# Altium project BEE-1012 PAY-EXP_V12.PrjPcb (part 3 of 4)

## Sheet 11_MCU.SchDoc
size 420 x 297 mm; SheetNumber: 20; SheetTotal: 36
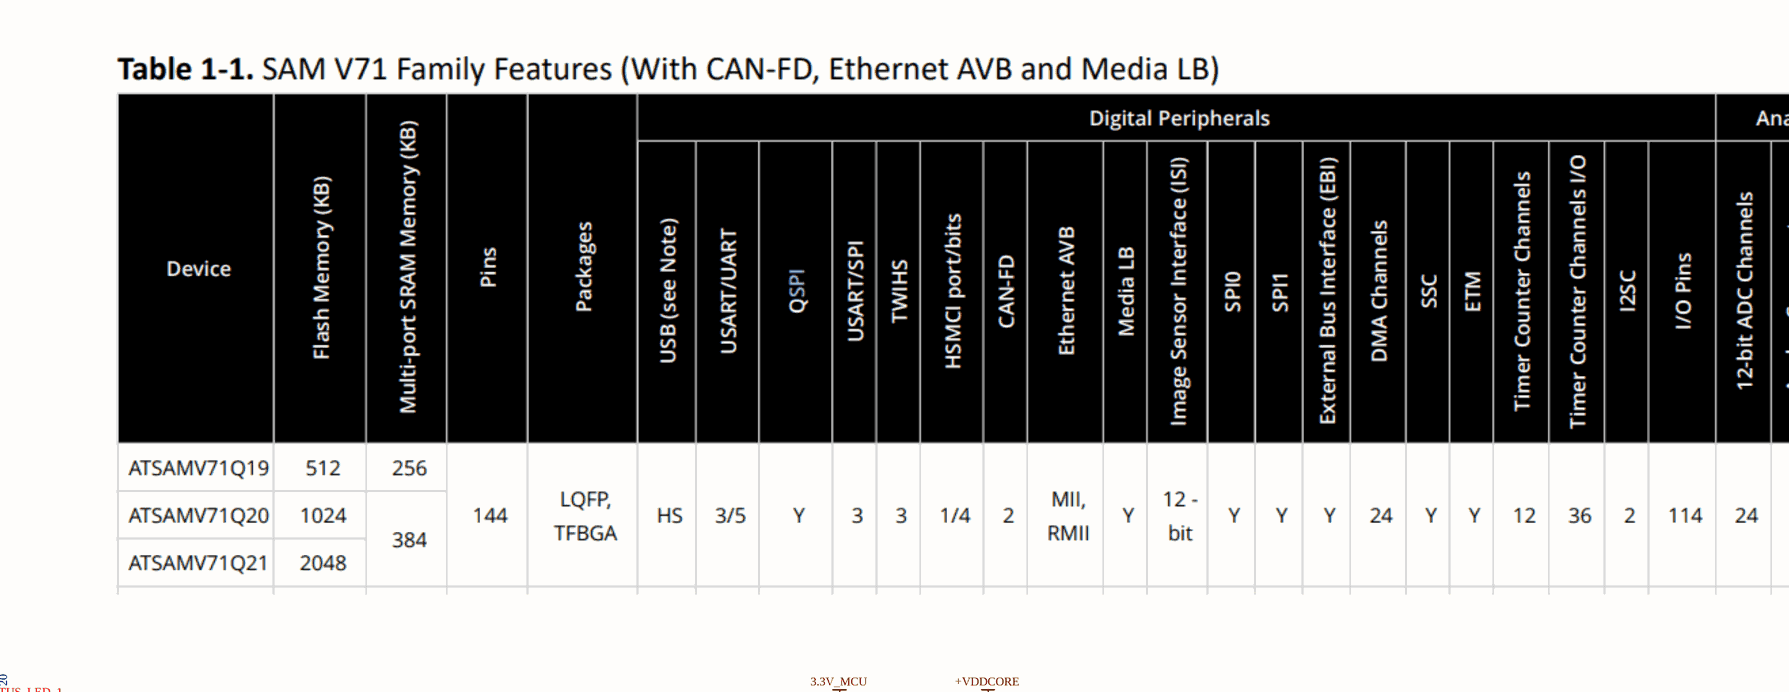
[diagram p18: 11_MCU.SchDoc, top left]
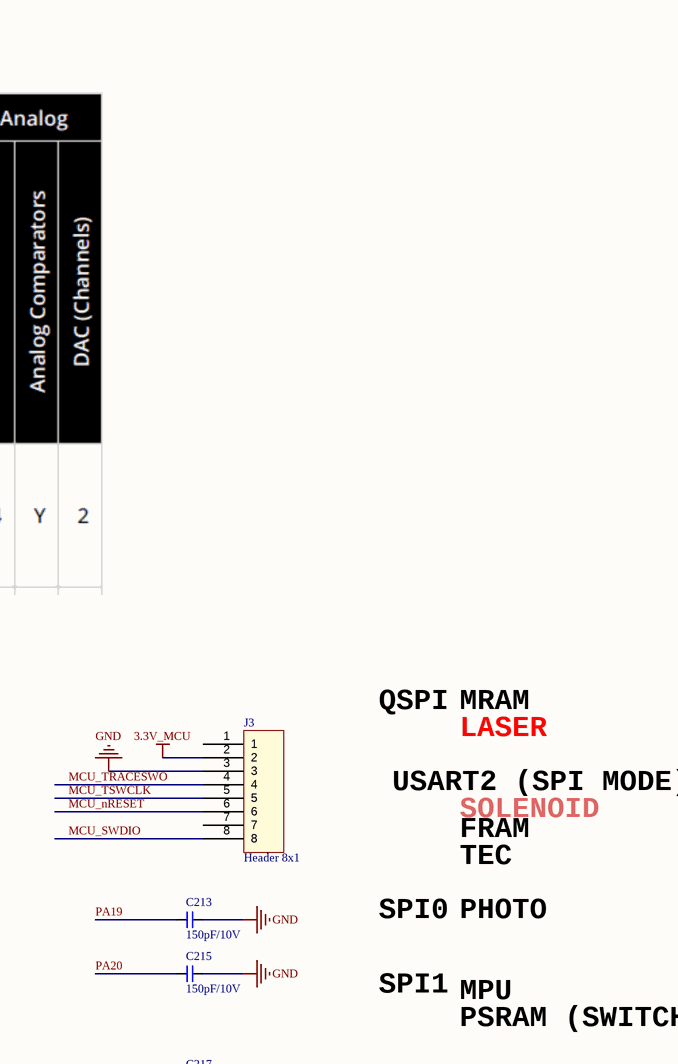
[diagram p19: 11_MCU.SchDoc, top right]
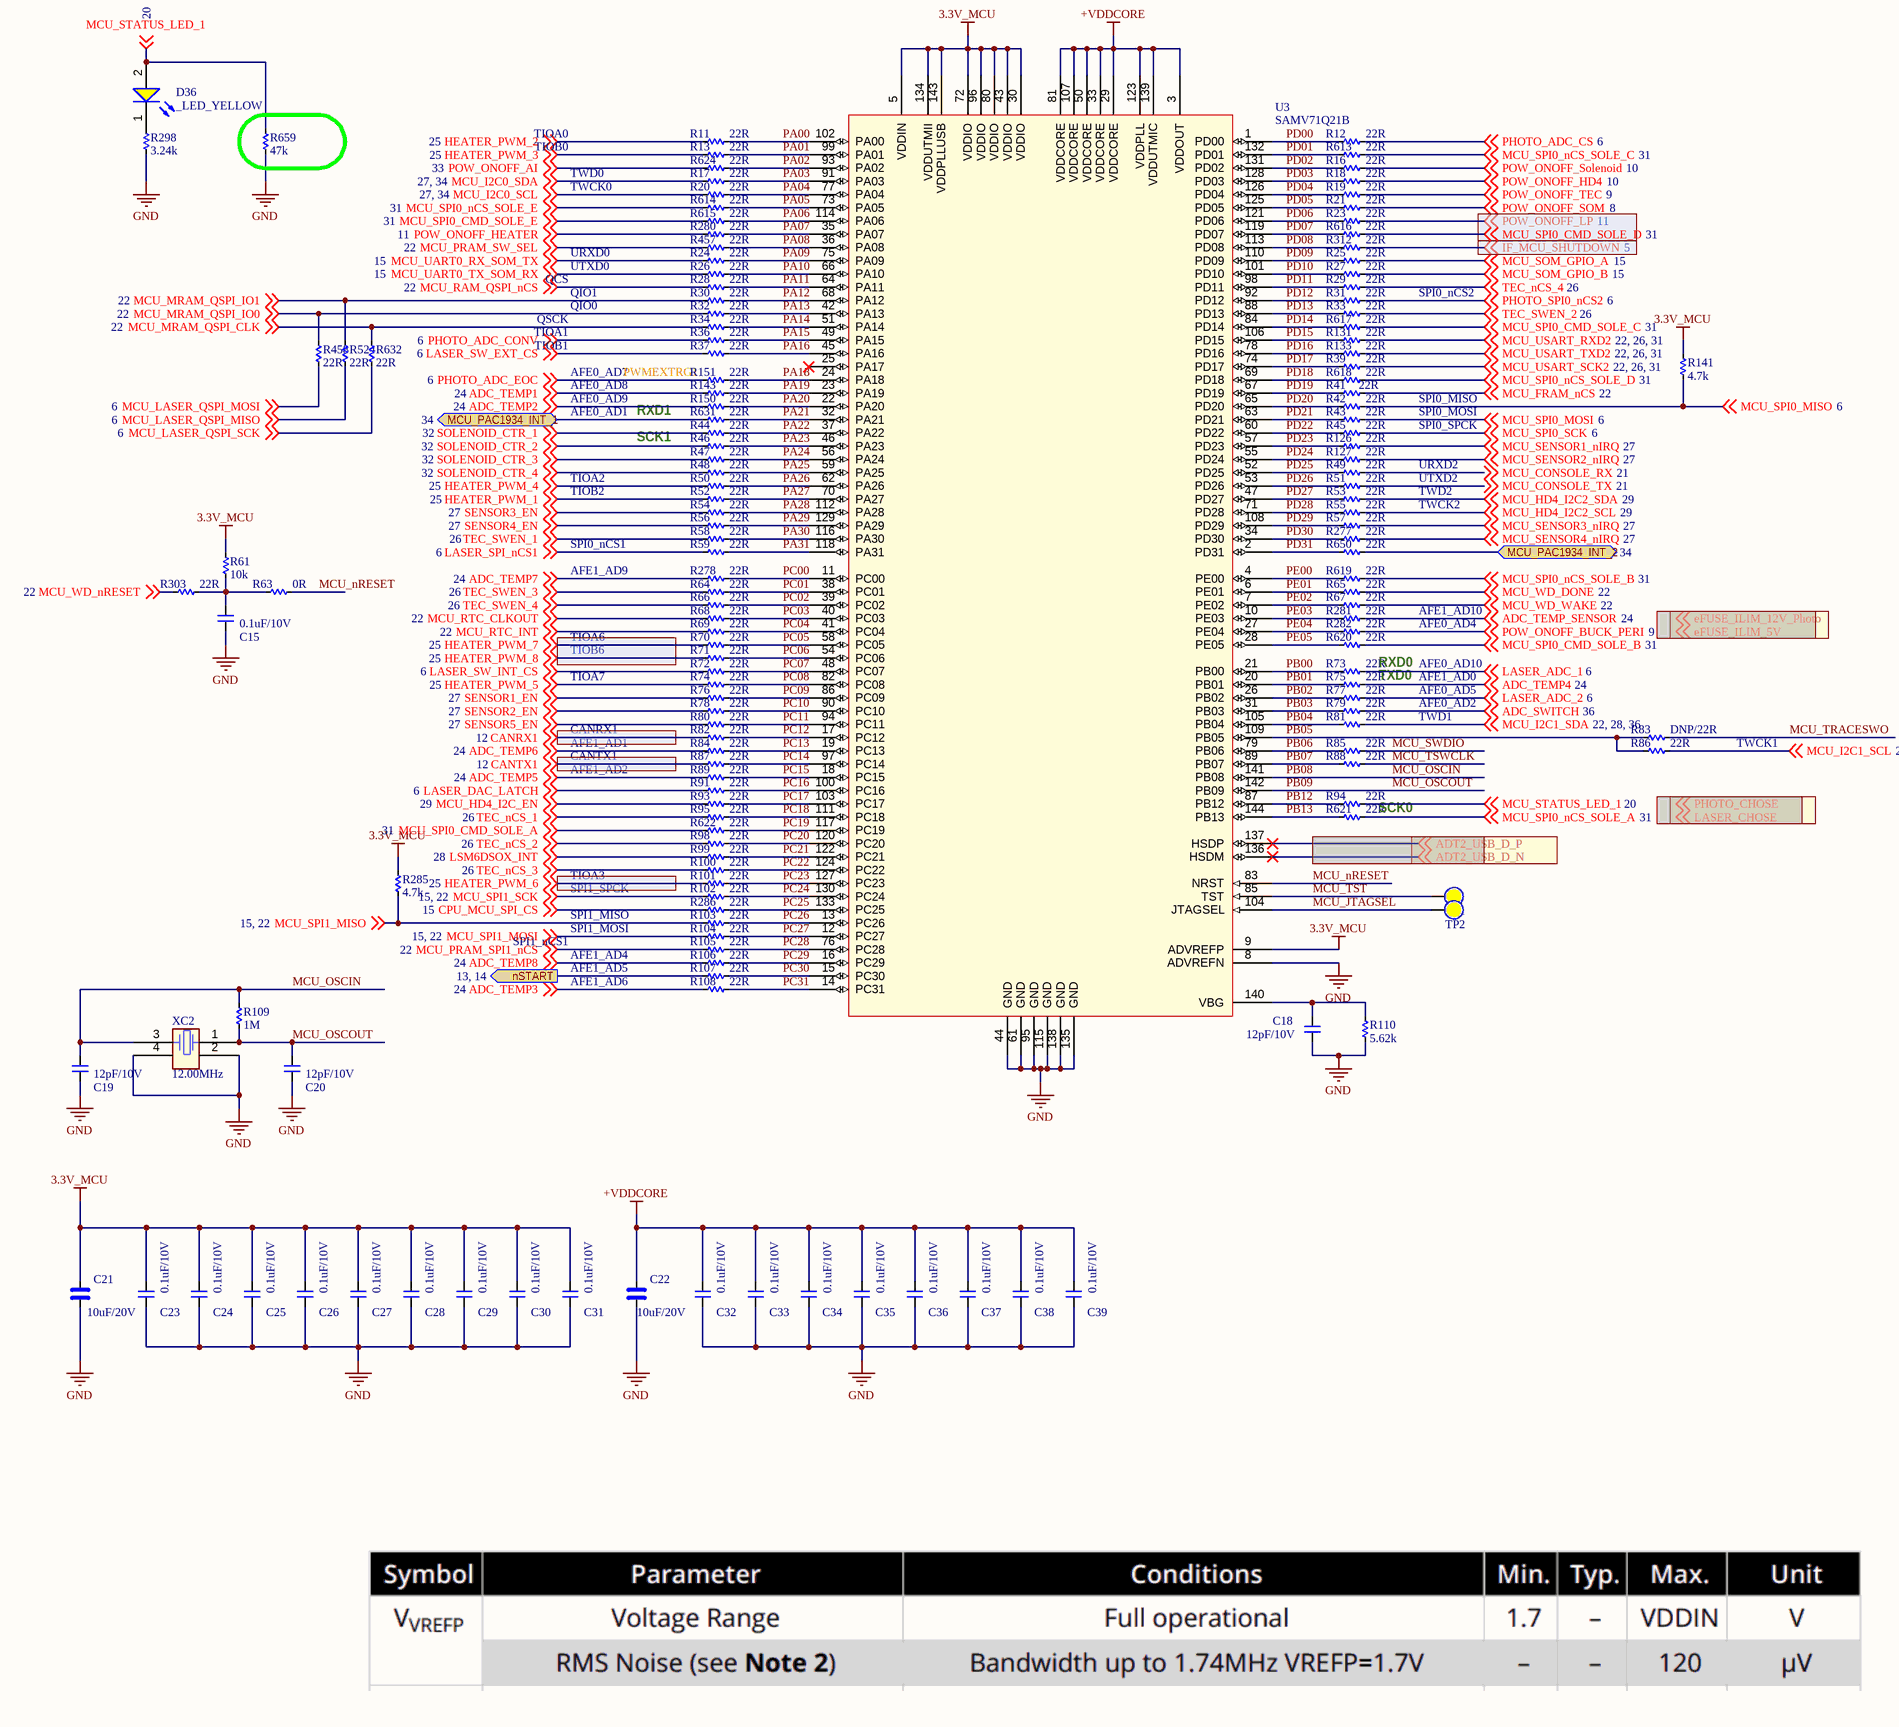
[diagram p20: 11_MCU.SchDoc, bottom left]
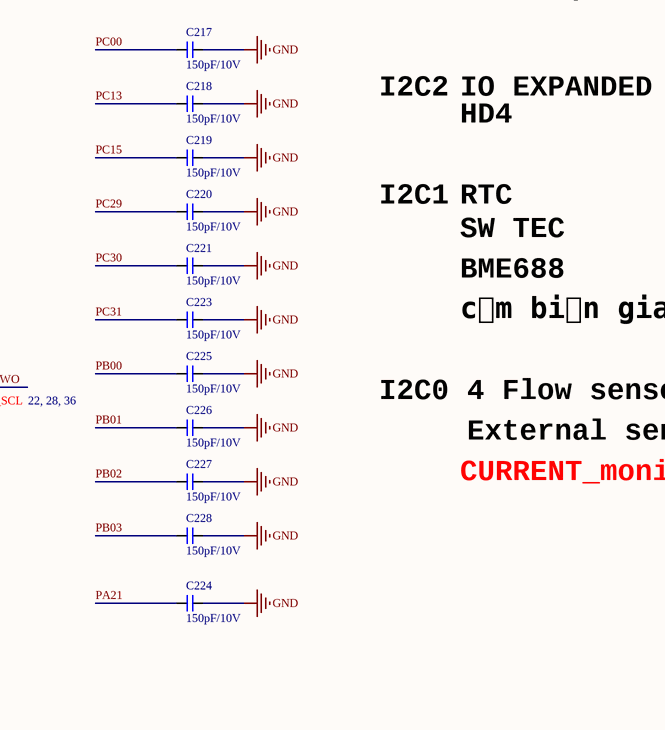
[diagram p21: 11_MCU.SchDoc, bottom right]

### Parts
C15  0.1uF/10V  [CAP_C_1005X60]
C18  12pF/10V  [CAP_C_1005X60]
C19  12pF/10V  [CAP_C_1005X60]
C20  12pF/10V  [CAP_C_1005X60]
C21  10uF/20V  [CAP_C_2012X110]
C22  10uF/20V  [CAP_C_2012X110]
C23  0.1uF/10V  [CAP_C_1005X60]
C24  0.1uF/10V  [CAP_C_1005X60]
C25  0.1uF/10V  [CAP_C_1005X60]
C26  0.1uF/10V  [CAP_C_1005X60]
C27  0.1uF/10V  [CAP_C_1005X60]
C28  0.1uF/10V  [CAP_C_1005X60]
C29  0.1uF/10V  [CAP_C_1005X60]
C30  0.1uF/10V  [CAP_C_1005X60]
C31  0.1uF/10V  [CAP_C_1005X60]
C32  0.1uF/10V  [CAP_C_1005X60]
C33  0.1uF/10V  [CAP_C_1005X60]
C34  0.1uF/10V  [CAP_C_1005X60]
C35  0.1uF/10V  [CAP_C_1005X60]
C36  0.1uF/10V  [CAP_C_1005X60]
C37  0.1uF/10V  [CAP_C_1005X60]
C38  0.1uF/10V  [CAP_C_1005X60]
C39  0.1uF/10V  [CAP_C_1005X60]
C213  150pF/10V  [CAP_C_1005X60]
C215  150pF/10V  [CAP_C_1005X60]
C217  150pF/10V  [CAP_C_1005X60]
C218  150pF/10V  [CAP_C_1005X60]
C219  150pF/10V  [CAP_C_1005X60]
C220  150pF/10V  [CAP_C_1005X60]
C221  150pF/10V  [CAP_C_1005X60]
C223  150pF/10V  [CAP_C_1005X60]
C224  150pF/10V  [CAP_C_1005X60]
C225  150pF/10V  [CAP_C_1005X60]
C226  150pF/10V  [CAP_C_1005X60]
C227  150pF/10V  [CAP_C_1005X60]
C228  150pF/10V  [CAP_C_1005X60]
D36  _LED_YELLOW  [LED_0603]
J3  Header 8x1  [Header_254P_8x1]
R11  22R  [RES_C_1005X40]
R12  22R  [RES_C_1005X40]
R13  22R  [RES_C_1005X40]
R16  22R  [RES_C_1005X40]
R17  22R  [RES_C_1005X40]
R18  22R  [RES_C_1005X40]
R19  22R  [RES_C_1005X40]
R20  22R  [RES_C_1005X40]
R21  22R  [RES_C_1005X40]
R23  22R  [RES_C_1005X40]
R24  22R  [RES_C_1005X40]
R25  22R  [RES_C_1005X40]
R26  22R  [RES_C_1005X40]
R27  22R  [RES_C_1005X40]
R28  22R  [RES_C_1005X40]
R29  22R  [RES_C_1005X40]
R30  22R  [RES_C_1005X40]
R31  22R  [RES_C_1005X40]
R32  22R  [RES_C_1005X40]
R33  22R  [RES_C_1005X40]
R34  22R  [RES_C_1005X40]
R36  22R  [RES_C_1005X40]
R37  22R  [RES_C_1005X40]
R39  22R  [RES_C_1005X40]
R41  22R  [RES_C_1005X40]
R42  22R  [RES_C_1005X40]
R43  22R  [RES_C_1005X40]
R44  22R  [RES_C_1005X40]
R45  22R  [RES_C_1005X40]
R46  22R  [RES_C_1005X40]
R47  22R  [RES_C_1005X40]
R48  22R  [RES_C_1005X40]
R49  22R  [RES_C_1005X40]
R50  22R  [RES_C_1005X40]
R51  22R  [RES_C_1005X40]
R52  22R  [RES_C_1005X40]
R53  22R  [RES_C_1005X40]
R54  22R  [RES_C_1005X40]
R55  22R  [RES_C_1005X40]
R56  22R  [RES_C_1005X40]
R57  22R  [RES_C_1005X40]
R58  22R  [RES_C_1005X40]
R59  22R  [RES_C_1005X40]
R61  10k  [RES_C_1005X40]
R63  0R  [RES_C_1005X40]
R64  22R  [RES_C_1005X40]
R65  22R  [RES_C_1005X40]
R66  22R  [RES_C_1005X40]
R67  22R  [RES_C_1005X40]
R68  22R  [RES_C_1005X40]
R69  22R  [RES_C_1005X40]
R70  22R  [RES_C_1005X40]
R71  22R  [RES_C_1005X40]
R72  22R  [RES_C_1005X40]
R73  22R  [RES_C_1005X40]
R74  22R  [RES_C_1005X40]
R75  22R  [RES_C_1005X40]
R76  22R  [RES_C_1005X40]
R77  22R  [RES_C_1005X40]
R78  22R  [RES_C_1005X40]
R79  22R  [RES_C_1005X40]
R80  22R  [RES_C_1005X40]
R81  22R  [RES_C_1005X40]
R82  22R  [RES_C_1005X40]
R83  DNP/22R  [RES_C_1005X40]
R84  22R  [RES_C_1005X40]
R85  22R  [RES_C_1005X40]
R86  22R  [RES_C_1005X40]
R87  22R  [RES_C_1005X40]
R88  22R  [RES_C_1005X40]
R89  22R  [RES_C_1005X40]
R91  22R  [RES_C_1005X40]
R93  22R  [RES_C_1005X40]
R94  22R  [RES_C_1005X40]
R95  22R  [RES_C_1005X40]
R98  22R  [RES_C_1005X40]
R99  22R  [RES_C_1005X40]
R100  22R  [RES_C_1005X40]
R101  22R  [RES_C_1005X40]
R102  22R  [RES_C_1005X40]
R103  22R  [RES_C_1005X40]
R104  22R  [RES_C_1005X40]
R105  22R  [RES_C_1005X40]
R106  22R  [RES_C_1005X40]
R107  22R  [RES_C_1005X40]
R108  22R  [RES_C_1005X40]
R109  1M  [RES_C_1005X40]
R110  5.62k  [RES_C_1005X40]
R126  22R  [RES_C_1005X40]
R127  22R  [RES_C_1005X40]
R131  22R  [RES_C_1005X40]
R133  22R  [RES_C_1005X40]
R141  4.7k  [RES_C_1005X40]
R143  22R  [RES_C_1005X40]
R150  22R  [RES_C_1005X40]
R151  22R  [RES_C_1005X40]
R277  22R  [RES_C_1005X40]
R278  22R  [RES_C_1005X40]
R280  22R  [RES_C_1005X40]
R281  22R  [RES_C_1005X40]
R282  22R  [RES_C_1005X40]
R285  4.7k  [RES_C_1005X40]
R286  22R  [RES_C_1005X40]
R298  3.24k  [RES_C_1005X40]
R303  22R  [RES_C_1005X40]
R312  22R  [RES_C_1005X40]
R457  22R  [RES_C_1005X40]
R458  22R  [RES_C_1005X40]
R524  22R  [RES_C_1005X40]
R613  22R  [RES_C_1005X40]
R614  22R  [RES_C_1005X40]
R615  22R  [RES_C_1005X40]
R616  22R  [RES_C_1005X40]
R617  22R  [RES_C_1005X40]
R618  22R  [RES_C_1005X40]
R619  22R  [RES_C_1005X40]
R620  22R  [RES_C_1005X40]
R621  22R  [RES_C_1005X40]
R622  22R  [RES_C_1005X40]
R624  22R  [RES_C_1005X40]
R631  22R  [RES_C_1005X40]
R632  22R  [RES_C_1005X40]
R650  22R  [RES_C_1005X40]
R659  47k  [RES_C_1608X60]
TP1  (no value)  [Testpoint_80]  (no BOM)
TP2  (no value)  [Testpoint_80]  (no BOM)
U3  SAMV71Q21B  [AP6-00118]
XC2  value 12.00MHz  [AP7-00039]  (hidden comment: FC5BQCCMC12.0-T1)

### Ports
MCU_PAC1934_INT_1 (bidir, see 34), MCU_PAC1934_INT_2 (bidir, see 34), nSTART (out, see 13, 14)

### Nets
3.3V_MCU: C21.1 C23.2 C24.2 C25.2 C26.2 C27.2 C28.2 C29.2 C30.2 C31.2 J3.2 R61.2 R141.1 R285.1 U3.5(VDDIN) U3.9(ADVREFP) U3.30(VDDIO) U3.43(VDDIO) U3.72(VDDIO) U3.80(VDDIO) U3.96(VDDIO) U3.134(VDDUTMII) U3.143(VDDPLLUSB)
+VDDCORE: C22.1 C32.2 C33.2 C34.2 C35.2 C36.2 C37.2 C38.2 C39.2 U3.3(VDDOUT) U3.29(VDDCORE) U3.33(VDDCORE) U3.50(VDDCORE) U3.81(VDDCORE) U3.107(VDDCORE) U3.123(VDDPLL) U3.139(VDDUTMIC)
GND: C15.1 C18.1 C19.1 C20.1 C21.2 C22.2 C23.1 C24.1 C25.1 C26.1 C27.1 C28.1 C29.1 C30.1 C31.1 C32.1 C33.1 C34.1 C35.1 C36.1 C37.1 C38.1 C39.1 C213.1 C215.1 C217.1 C218.1 C219.1 C220.1 C221.1 C223.1 C224.1 C225.1 C226.1 C227.1 C228.1 J3.3 R110.1 R298.2 R659.2 U3.8(ADVREFN) U3.44(GND) U3.61(GND) U3.95(GND) U3.115(GND) U3.135(GND) U3.138(GND) XC2.2 XC2.4
ADC_SWITCH: R79.1 ; off-sheet ADC_SWITCH
ADC_TEMP1: R143.2 ; off-sheet ADC_TEMP1
ADC_TEMP2: R150.2 ; off-sheet ADC_TEMP2
ADC_TEMP3: R108.2 ; off-sheet ADC_TEMP3
ADC_TEMP4: R75.1 ; off-sheet ADC_TEMP4
ADC_TEMP5: R89.2 ; off-sheet ADC_TEMP5
ADC_TEMP6: R84.2 ; off-sheet ADC_TEMP6
ADC_TEMP7: R278.2 ; off-sheet ADC_TEMP7
ADC_TEMP8: R106.2 ; off-sheet ADC_TEMP8
ADC_TEMP_SENSOR: R281.1 ; off-sheet ADC_TEMP_SENSOR  [project net TEMP _SENSOR]
CANRX1: R82.2 ; off-sheet CANRX1
CANTX1: R87.2 ; off-sheet CANTX1
CPU_MCU_SPI_CS: R286.2 ; off-sheet CPU_MCU_SPI_CS
HEATER_PWM_1: R52.2 ; off-sheet HEATER_PWM_1
HEATER_PWM_2: R11.2 ; off-sheet HEATER_PWM_2
HEATER_PWM_3: R13.2 ; off-sheet HEATER_PWM_3
HEATER_PWM_4: R50.2 ; off-sheet HEATER_PWM_4
HEATER_PWM_5: R74.2 ; off-sheet HEATER_PWM_5
HEATER_PWM_6: R101.2 ; off-sheet HEATER_PWM_6
HEATER_PWM_7: R70.2 ; off-sheet HEATER_PWM_7
HEATER_PWM_8: R71.2 ; off-sheet HEATER_PWM_8
IF_MCU_SHUTDOWN: R312.1 ; off-sheet IF_MCU_SHUTDOWN
LASER_ADC_1: R73.1 ; off-sheet LASER_ADC_1
LASER_ADC_2: R77.1 ; off-sheet LASER_ADC_2
LASER_DAC_LATCH: R91.2 ; off-sheet LASER_DAC_LATCH
LASER_SPI_nCS1: R59.2 ; off-sheet LASER_SPI_nCS1
LASER_SW_EXT_CS: R37.2 ; off-sheet LASER_SW_EXT_CS
LASER_SW_INT_CS: R72.2 ; off-sheet LASER_SW_INT_CS
LSM6DSOX_INT: R99.2 ; off-sheet LSM6DSOX_INT
MCU_CONSOLE_RX: R49.1 ; off-sheet MCU_CONSOLE_RX
MCU_CONSOLE_TX: R51.1 ; off-sheet MCU_CONSOLE_TX
MCU_FRAM_nCS: R41.2 ; off-sheet MCU_FRAM_nCS
MCU_HD4_I2C2_SCL: R55.1 ; off-sheet MCU_HD4_I2C2_SCL
MCU_HD4_I2C2_SDA: R53.1 ; off-sheet MCU_HD4_I2C2_SDA
MCU_HD4_I2C_EN: R93.2 ; off-sheet MCU_HD4_I2C_EN
MCU_I2C0_SCL: R20.2 ; off-sheet MCU_I2C0_SCL
MCU_I2C0_SDA: R17.2 ; off-sheet MCU_I2C0_SDA
MCU_I2C1_SCL: R86.1 ; off-sheet MCU_I2C1_SCL
MCU_I2C1_SDA: R81.1 ; off-sheet MCU_I2C1_SDA
MCU_JTAGSEL: TP2.1 U3.104(JTAGSEL)
MCU_LASER_QSPI_MISO: R524.2 ; off-sheet MCU_LASER_QSPI_MISO
MCU_LASER_QSPI_MOSI: R458.2 ; off-sheet MCU_LASER_QSPI_MOSI
MCU_LASER_QSPI_SCK: R632.2 ; off-sheet MCU_LASER_QSPI_SCK
MCU_MRAM_QSPI_CLK: R34.2 R632.1 ; off-sheet MCU_MRAM_QSPI_CLK
MCU_MRAM_QSPI_IO0: R32.2 R458.1 ; off-sheet MCU_MRAM_QSPI_IO0
MCU_MRAM_QSPI_IO1: R30.2 R524.1 ; off-sheet MCU_MRAM_QSPI_IO1
MCU_nRESET: J3.6 R63.1 U3.83(NRST)
MCU_OSCIN: C19.2 R109.2 U3.141(PB08) XC2.3  [also labelled PB08]
MCU_OSCOUT: C20.2 R109.1 U3.142(PB09) XC2.1  [also labelled PB09]
MCU_PRAM_SPI1_nCS: R105.2 ; off-sheet MCU_PRAM_SPI1_nCS
MCU_PRAM_SW_SEL: R457.2 ; off-sheet MCU_PRAM_SW_SEL
MCU_RAM_QSPI_nCS: R28.2 ; off-sheet MCU_RAM_QSPI_nCS
MCU_RTC_CLKOUT: R68.2 ; off-sheet MCU_RTC_CLKOUT
MCU_RTC_INT: R69.2 ; off-sheet MCU_RTC_INT
MCU_SENSOR1_nIRQ: R126.1 ; off-sheet MCU_SENSOR1_nIRQ
MCU_SENSOR2_nIRQ: R127.1 ; off-sheet MCU_SENSOR2_nIRQ
MCU_SENSOR3_nIRQ: R57.2 ; off-sheet MCU_SENSOR3_nIRQ
MCU_SENSOR4_nIRQ: R277.2 ; off-sheet MCU_SENSOR4_nIRQ
MCU_SOM_GPIO_A: R25.1 ; off-sheet MCU_SOM_GPIO_A
MCU_SOM_GPIO_B: R27.1 ; off-sheet MCU_SOM_GPIO_B
MCU_SPI0_CMD_SOLE_A: R622.2 ; off-sheet MCU_SPI0_CMD_SOLE_A
MCU_SPI0_CMD_SOLE_B: R620.1 ; off-sheet MCU_SPI0_CMD_SOLE_B
MCU_SPI0_CMD_SOLE_C: R617.1 ; off-sheet MCU_SPI0_CMD_SOLE_C
MCU_SPI0_CMD_SOLE_D: R616.1 ; off-sheet MCU_SPI0_CMD_SOLE_D
MCU_SPI0_CMD_SOLE_E: R615.2 ; off-sheet MCU_SPI0_CMD_SOLE_E
MCU_SPI0_MISO: R42.1 R141.2 ; off-sheet MCU_SPI0_MISO
MCU_SPI0_MOSI: R43.1 ; off-sheet MCU_SPI0_MOSI
MCU_SPI0_nCS_SOLE_A: R621.1 ; off-sheet MCU_SPI0_nCS_SOLE_A
MCU_SPI0_nCS_SOLE_B: R619.1 ; off-sheet MCU_SPI0_nCS_SOLE_B
MCU_SPI0_nCS_SOLE_C: R613.1 ; off-sheet MCU_SPI0_nCS_SOLE_C
MCU_SPI0_nCS_SOLE_D: R618.1 ; off-sheet MCU_SPI0_nCS_SOLE_D
MCU_SPI0_nCS_SOLE_E: R614.2 ; off-sheet MCU_SPI0_nCS_SOLE_E
MCU_SPI0_SCK: R45.1 ; off-sheet MCU_SPI0_SCK
MCU_SPI1_MISO: R103.2 R285.2 ; off-sheet MCU_SPI1_MISO
MCU_SPI1_MOSI: R104.2 ; off-sheet MCU_SPI1_MOSI
MCU_SPI1_SCK: R102.2 ; off-sheet MCU_SPI1_SCK
MCU_STATUS_LED_1: D36.2(A) R94.1 R659.1 ; off-sheet MCU_STATUS_LED_1
MCU_SWDIO: J3.8 R85.1
MCU_TRACESWO: J3.4 R83.1
MCU_TST: TP1.1 U3.85(TST)
MCU_TSWCLK: J3.5 R88.1
MCU_UART0_RX_SOM_TX: R24.2 ; off-sheet MCU_UART0_RX_SOM_TX
MCU_UART0_TX_SOM_RX: R26.2 ; off-sheet MCU_UART0_TX_SOM_RX
MCU_USART_RXD2: R131.1 ; off-sheet MCU_USART_RXD2
MCU_USART_SCK2: R39.1 ; off-sheet MCU_USART_SCK2
MCU_USART_TXD2: R133.1 ; off-sheet MCU_USART_TXD2
MCU_WD_DONE: R65.1 ; off-sheet MCU_WD_DONE
MCU_WD_nRESET: R303.2 ; off-sheet MCU_WD_nRESET
MCU_WD_WAKE: R67.1 ; off-sheet MCU_WD_WAKE
PA00: R11.1 U3.102(PA00)
PA01: R13.1 U3.99(PA01)
PA02: R624.1 U3.93(PA02)
PA03: R17.1 U3.91(PA03)
PA04: R20.1 U3.77(PA04)
PA05: R614.1 U3.73(PA05)
PA06: R615.1 U3.114(PA06)
PA07: R280.1 U3.35(PA07)
PA08: R457.1 U3.36(PA08)
PA09: R24.1 U3.75(PA09)
PA10: R26.1 U3.66(PA10)
PA11: R28.1 U3.64(PA11)
PA12: R30.1 U3.68(PA12)
PA13: R32.1 U3.42(PA13)
PA14: R34.1 U3.51(PA14)
PA15: R36.1 U3.49(PA15)
PA16: R37.1 U3.45(PA16)
PA18: R151.1 U3.24(PA18)
PA19: C213.2 R143.1 U3.23(PA19)
PA20: C215.2 R150.1 U3.22(PA20)
PA21: C224.2 R631.1 U3.32(PA21)
PA22: R44.1 U3.37(PA22)
PA23: R46.1 U3.46(PA23)
PA24: R47.1 U3.56(PA24)
PA25: R48.1 U3.59(PA25)
PA26: R50.1 U3.62(PA26)
PA27: R52.1 U3.70(PA27)
PA28: R54.1 U3.112(PA28)
PA29: R56.1 U3.129(PA29)
PA30: R58.1 U3.116(PA30)
PA31: R59.1 U3.118(PA31)
PB00: C225.2 R73.2 U3.21(PB00)
PB01: C226.2 R75.2 U3.20(PB01)
PB02: C227.2 R77.2 U3.26(PB02)
PB03: C228.2 R79.2 U3.31(PB03)
PB04: R81.2 U3.105(PB04)
PB05: R83.2 R86.2 U3.109(PB05)
PB06: R85.2 U3.79(PB06)
PB07: R88.2 U3.89(PB07)
PB12: R94.2 U3.87(PB12)
PB13: R621.2 U3.144(PB13)
PC00: C217.2 R278.1 U3.11(PC00)
PC01: R64.1 U3.38(PC01)
PC02: R66.1 U3.39(PC02)
PC03: R68.1 U3.40(PC03)
PC04: R69.1 U3.41(PC04)
PC05: R70.1 U3.58(PC05)
PC06: R71.1 U3.54(PC06)
PC07: R72.1 U3.48(PC07)
PC08: R74.1 U3.82(PC08)
PC09: R76.1 U3.86(PC09)
PC10: R78.1 U3.90(PC10)
PC11: R80.1 U3.94(PC11)
PC12: R82.1 U3.17(PC12)
PC13: C218.2 R84.1 U3.19(PC13)
PC14: R87.1 U3.97(PC14)
PC15: C219.2 R89.1 U3.18(PC15)
PC16: R91.1 U3.100(PC16)
PC17: R93.1 U3.103(PC17)
PC18: R95.1 U3.111(PC18)
PC19: R622.1 U3.117(PC19)
PC20: R98.1 U3.120(PC20)
PC21: R99.1 U3.122(PC21)
PC22: R100.1 U3.124(PC22)
PC23: R101.1 U3.127(PC23)
PC24: R102.1 U3.130(PC24)
PC25: R286.1 U3.133(PC25)
PC26: R103.1 U3.13(PC26)
PC27: R104.1 U3.12(PC27)
PC28: R105.1 U3.76(PC28)
PC29: C220.2 R106.1 U3.16(PC29)
PC30: C221.2 R107.1 U3.15(PC30)
PC31: C223.2 R108.1 U3.14(PC31)
PD00: R12.2 U3.1(PD00)
PD01: R613.2 U3.132(PD01)
PD02: R16.2 U3.131(PD02)
PD03: R18.2 U3.128(PD03)
PD04: R19.2 U3.126(PD04)
PD05: R21.2 U3.125(PD05)
PD06: R23.2 U3.121(PD06)
PD07: R616.2 U3.119(PD07)
PD08: R312.2 U3.113(PD08)
PD09: R25.2 U3.110(PD09)
PD10: R27.2 U3.101(PD10)
PD11: R29.2 U3.98(PD11)
PD12: R31.2 U3.92(PD12)
PD13: R33.2 U3.88(PD13)
PD14: R617.2 U3.84(PD14)
PD15: R131.2 U3.106(PD15)
PD16: R133.2 U3.78(PD16)
PD17: R39.2 U3.74(PD17)
PD18: R618.2 U3.69(PD18)
PD19: R41.1 U3.67(PD19)
PD20: R42.2 U3.65(PD20)
PD21: R43.2 U3.63(PD21)
PD22: R45.2 U3.60(PD22)
PD23: R126.2 U3.57(PD23)
PD24: R127.2 U3.55(PD24)
PD25: R49.2 U3.52(PD25)
PD26: R51.2 U3.53(PD26)
PD27: R53.2 U3.47(PD27)
PD28: R55.2 U3.71(PD28)
PD29: R57.1 U3.108(PD29)
PD30: R277.1 U3.34(PD30)
PD31: R650.1 U3.2(PD31)
PE00: R619.2 U3.4(PE00)
PE01: R65.2 U3.6(PE01)
PE02: R67.2 U3.7(PE02)
PE03: R281.2 U3.10(PE03)
PE04: R282.2 U3.27(PE04)
PE05: R620.2 U3.28(PE05)
PHOTO_ADC_CONV: R36.2 ; off-sheet PHOTO_ADC_CONV
PHOTO_ADC_CS: R12.1 ; off-sheet PHOTO_ADC_CS
PHOTO_ADC_EOC: R151.2 ; off-sheet PHOTO_ADC_EOC
PHOTO_SPI0_nCS2: R31.1 ; off-sheet PHOTO_SPI0_nCS2
POW_ONOFF_AI: R624.2 ; off-sheet POW_ONOFF_AI
POW_ONOFF_BUCK_PERI: R282.1 ; off-sheet POW_ONOFF_BUCK_PERI
POW_ONOFF_HD4: R18.1 ; off-sheet POW_ONOFF_HD4
POW_ONOFF_HEATER: R280.2 ; off-sheet POW_ONOFF_HEATER
POW_ONOFF_LP: R23.1 ; off-sheet POW_ONOFF_LP
POW_ONOFF_Solenoid: R16.1 ; off-sheet POW_ONOFF_Solenoid
POW_ONOFF_SOM: R21.1 ; off-sheet POW_ONOFF_SOM
POW_ONOFF_TEC: R19.1 ; off-sheet POW_ONOFF_TEC
SENSOR1_EN: R76.2 ; off-sheet SENSOR1_EN
SENSOR2_EN: R78.2 ; off-sheet SENSOR2_EN
SENSOR3_EN: R54.2 ; off-sheet SENSOR3_EN
SENSOR4_EN: R56.2 ; off-sheet SENSOR4_EN
SENSOR5_EN: R80.2 ; off-sheet SENSOR5_EN
SOLENOID_CTR_1: R44.2 ; off-sheet SOLENOID_CTR_1
SOLENOID_CTR_2: R46.2 ; off-sheet SOLENOID_CTR_2
SOLENOID_CTR_3: R47.2 ; off-sheet SOLENOID_CTR_3
SOLENOID_CTR_4: R48.2 ; off-sheet SOLENOID_CTR_4
TEC_nCS_1: R95.2 ; off-sheet TEC_nCS_1
TEC_nCS_2: R98.2 ; off-sheet TEC_nCS_2
TEC_nCS_3: R100.2 ; off-sheet TEC_nCS_3
TEC_nCS_4: R29.1 ; off-sheet TEC_nCS_4
TEC_SWEN_1: R58.2 ; off-sheet TEC_SWEN_1
TEC_SWEN_2: R33.1 ; off-sheet TEC_SWEN_2
TEC_SWEN_3: R64.2 ; off-sheet TEC_SWEN_3
TEC_SWEN_4: R66.2 ; off-sheet TEC_SWEN_4
NetC15_2: C15.2 R61.1 R63.2 R303.1
NetC18_2: C18.2 R110.2 U3.140(VBG)
NetC355_1: R107.2 ; port nSTART
NetD36_1: D36.1(K) R298.1
NetR558_2: R631.2 ; port MCU_PAC1934_INT_1
NetR562_2: R650.2 ; port MCU_PAC1934_INT_2

Not connected (* = marked no-connect by the designer): J3 1 7; U3 25(PA17)* 136(HSDM)* 137(HSDP)*

### Notes on the sheet
- QSPI
- LASER
- MRAM
- TIOA0
- USART2 (SPI MODE)
- TWD0
- TWCK0
- TIOB0
- TEC
- FRAM
- SOLENOID
- URXD0
- UTXD0
- SPI0
- PHOTO
- QIO1
- QCS
- QSCK
- QIO0
- TIOA1
- SPI0_nCS2
- SPI1
- MPU
- AFE0_AD8
- AFE0_AD9
- AFE0_AD7
- TIOB1
- PWMEXTRG1
- SPI0_MISO
- PSRAM (SWITCH SOM)
- AFE0_AD1
- SCK1
- RXD1
- SPI0_MOSI
- SPI0_SPCK
- URXD2
- I2C2
- IO EXPANDED
- TIOA2
- TIOB2
- TWD2
- TWCK2
- UTXD2
- HD4
- SPI0_nCS1
- AFE1_AD9
- I2C1
- RTC
- SW TEC
- TIOA6
- TIOB6
- RXD0
- AFE1_AD10
- AFE0_AD4
- AFE0_AD10
- BME688
- CANRX1
- TIOA7
- TXD0
- AFE0_AD2
- AFE0_AD5
- AFE1_AD0
- TWD1
- cảm biến gia tốc
- AFE1_AD2
- AFE1_AD1
- CANTX1
- TWCK1
- I2C0
- 4 Flow sensor
- External sensor
- SCK0
- CURRENT_monitor
- SPI1_MISO
- SPI1_MOSI
- SPI1_SPCK
- TIOA3
- SPI1_nCS1
- AFE1_AD4
- AFE1_AD5
- AFE1_AD6
- Project:
- Sub-system:
- Design by:
- Sheet title:
- Sheet
- of
- Checked by:
- Approved by:
- Revision:
- Document No:
- Size:
- Date:
- A3

### Library data of the parts
C15 C18-C20 C23-C39 C213 C215 C217-C221 C223-C228 = _CAP_C_2: CAP
C21 C22 = _CAP_C_High_2: CAP High Value
R11-R13 R16-R21 R23-R34 R36 R37 R39 R41-R59 R61 R63-R89 R91 R93-R95 R98-R110 R126 R127 R131 R133 R141 R143 R150 R151 R277 R278 R280-R282 R285 R286 R298 R303 R312 R457 R458 R524 R613-R622 R624 R631 R632 R650 R659 = _RES_B_2: RES
TP1 TP2 = Test Point: Solder: NF
U3 = A06-1541: SAM 32-bit ARM Cortex-M* RISC MCU, SAMV71B Series, QFP144; PartGroup: Integrated Circuits,MCU, MPU, DSP,ARM MCU; Manufacturer: MICROCHIP; MPN: ATSAMV71Q21B-AAB; TemperatureRange: -40Â°C to +105Â°C; AN: A06-1541; Value: SAMV71Q21B; Height: 1,60000002384186
XC2 = A07-0042: Fox FQ5032B 12.0MHz SMD crystal 738B-12; PartGroup: Frequency devices,Crystals,SMD; Manufacturer: Fox  Electronics; MPN: FQ5032B-12.000; Tolerance: Â±30ppm; TemperatureRange: 0Â°C ~ 70Â°C; AN: A07-0042; Height: 1,20000004768372

## Sheet 12_CONSOLE.SchDoc
size 420 x 297 mm; SheetNumber: 21; SheetTotal: 36
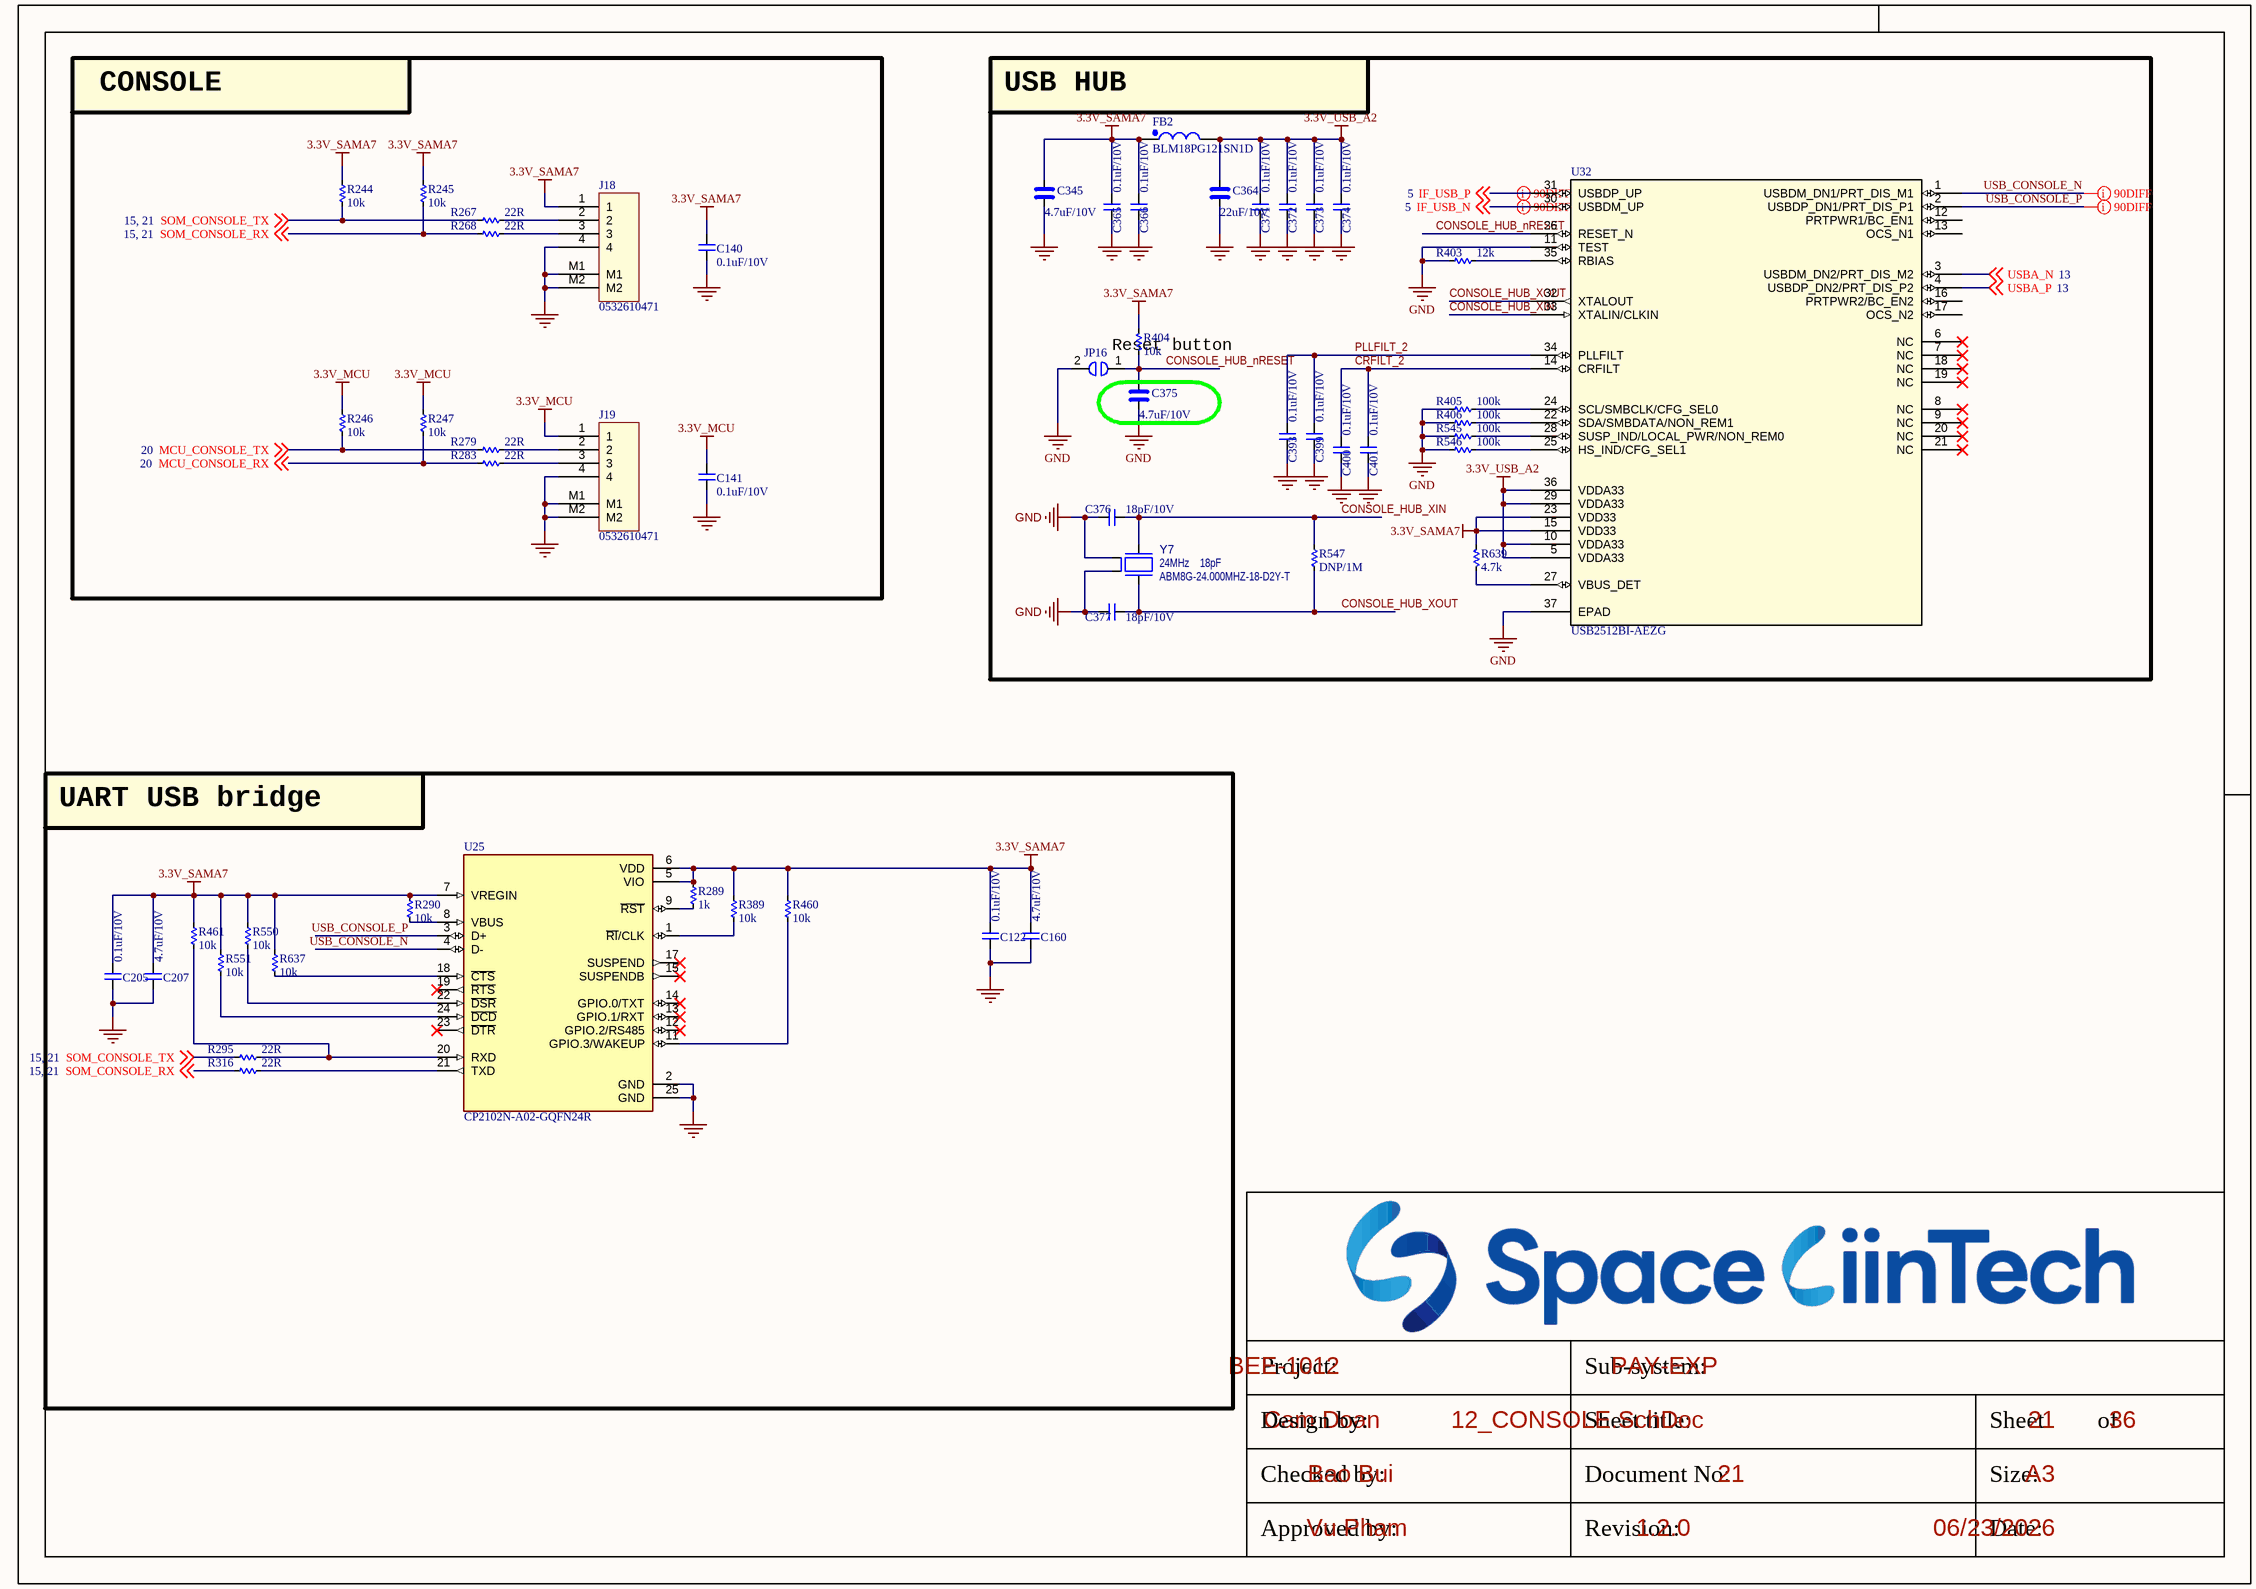
[diagram p22: 12_CONSOLE.SchDoc]

### Parts
C122  0.1uF/10V  [CAP_C_1005X60]
C140  0.1uF/10V  [CAP_C_1005X60]
C141  0.1uF/10V  [CAP_C_1005X60]
C160  4.7uF/10V  [CAP_C_1005X60]
C205  0.1uF/10V  [CAP_C_1005X60]
C207  4.7uF/10V  [CAP_C_1005X60]
C345  4.7uF/10V  [CAP_C_1608X80]
C364  22uF/10V  [CAP_C_1608X80]
C365  0.1uF/10V  [CAP_C_1005X60]
C366  0.1uF/10V  [CAP_C_1005X60]
C371  0.1uF/10V  [CAP_C_1005X60]
C372  0.1uF/10V  [CAP_C_1005X60]
C373  0.1uF/10V  [CAP_C_1005X60]
C374  0.1uF/10V  [CAP_C_1005X60]
C375  4.7uF/10V  [CAP_C_1608X80]
C376  18pF/10V  [CAP_C_1005X60]
C377  18pF/10V  [CAP_C_1005X60]
C393  0.1uF/10V  [CAP_C_1005X60]
C399  0.1uF/10V  [CAP_C_1005X60]
C400  0.1uF/10V  [CAP_C_1005X60]
C401  0.1uF/10V  [CAP_C_1005X60]
FB2  BLM18PG121SN1D  [IND_C_1608X60]
J18  0532610471  [MOLEX_0532610471]
J19  0532610471  [MOLEX_0532610471]
JP16  (no value)  [TESTPOINT_SHORT_120X100_60]
R244  10k  [RES_C_1005X40]
R245  10k  [RES_C_1005X40]
R246  10k  [RES_C_1005X40]
R247  10k  [RES_C_1005X40]
R267  22R  [RES_C_1005X40]
R268  22R  [RES_C_1005X40]
R279  22R  [RES_C_1005X40]
R283  22R  [RES_C_1005X40]
R289  1k  [RES_C_1005X40]
R290  10k  [RES_C_1005X40]
R295  22R  [RES_C_1005X40]
R316  22R  [RES_C_1005X40]
R389  10k  [RES_C_1005X40]
R403  12k  [RES_C_1005X40]
R404  10k  [RES_C_1005X40]
R405  100k  [RES_C_1005X40]
R406  100k  [RES_C_1005X40]
R460  10k  [RES_C_1005X40]
R461  10k  [RES_C_1005X40]
R545  100k  [RES_C_1005X40]
R546  100k  [RES_C_1005X40]
R547  DNP/1M  [RES_C_1005X40]
R550  10k  [RES_C_1005X40]
R551  10k  [RES_C_1005X40]
R637  10k  [RES_C_1005X40]
R639  4.7k  [RES_C_1005X40]
U25  CP2102N-A02-GQFN24R  [QFN50P400X400X80-25N]
U32  USB2512BI-AEZG  [QFN36_6X6MC_MCH]
Y7  value 24MHz  Load Capacitance: 18pF  Manufacturer Part Number 1: ABM8G-24.000MHZ-18-D2Y-T  [CRYSTAL_ABM8G]  (hidden comment: Crystal 4 Pins)

### Blocks framed on the sheet
CONSOLE: C140 C141 J18 J19 R244-R247 R267 R268 R279 R283
USB HUB: C345 C364-C366 C371-C377 C393 C399-C401 FB2 JP16 R403-R406 R545-R547 R639 U32 Y7
UART USB bridge: C122 C160 C205 C207 R289 R290 R295 R316 R389 R460 R461 R550 R551 R637 U25

### Nets
3.3V_MCU: C141.2 J19.1 R246.2 R247.2
3.3V_SAMA7: C122.1 C140.2 C160.1 C205.1 C207.1 C345.1 C365.2 C366.2 FB2.1 J18.1 R244.2 R245.2 R289.2 R290.2 R389.2 R404.1 R460.2 R461.2 R550.2 R551.2 R637.2 R639.1 U25.5(VIO) U25.6(VDD) U25.7(VREGIN) U32.15(VDD33) U32.23(VDD33)
3.3V_USB_A2: C364.1 C371.2 C372.2 C373.2 C374.2 FB2.2 U32.5(VDDA33) U32.10(VDDA33) U32.29(VDDA33) U32.36(VDDA33)
GND: C122.2 C140.1 C141.1 C160.2 C205.2 C207.2 C345.2 C364.2 C365.1 C366.1 C371.1 C372.1 C373.1 C374.1 C375.2 C376.2 C377.2 C393.1 C399.1 C400.1 C401.1 J18.4 J18.M1 J18.M2 J19.4 J19.M1 J19.M2 JP16.2 R403.1 R405.1 R406.1 R545.1 R546.1 U25.2(GND) U25.25(GND) U32.11(TEST) U32.37(EPAD) Y7.2(GND) Y7.4(GND)
CONSOLE_HUB_nRESET: C375.1 JP16.1 R404.2 U32.26(RESET_N)
CONSOLE_HUB_XIN: C376.1 R547.1 U32.33(XTALIN/CLKIN) Y7.3(Osc2)
CONSOLE_HUB_XOUT: C377.1 R547.2 U32.32(XTALOUT) Y7.1(Osc1)
CRFILT_2: C400.2 C401.2 U32.14(CRFILT)
IF_USB_N: U32.30(USBDM_UP) ; off-sheet IF_USB_N
IF_USB_P: U32.31(USBDP_UP) ; off-sheet IF_USB_P
MCU_CONSOLE_RX: R247.1 R283.2 ; off-sheet MCU_CONSOLE_RX
MCU_CONSOLE_TX: R246.1 R279.2 ; off-sheet MCU_CONSOLE_TX
PLLFILT_2: C393.2 C399.2 U32.34(PLLFILT)
SOM_CONSOLE_RX: R245.1 R268.2 R316.2 ; off-sheet SOM_CONSOLE_RX
SOM_CONSOLE_TX: R244.1 R267.2 R295.2 ; off-sheet SOM_CONSOLE_TX
USB_CONSOLE_N: U25.4(D-) U32.1(USBDM_DN1/PRT_DIS_M1)
USB_CONSOLE_P: U25.3(D+) U32.2(USBDP_DN1/PRT_DIS_P1)
USBA_N: U32.3(USBDM_DN2/PRT_DIS_M2) ; off-sheet USBA_N
USBA_P: U32.4(USBDP_DN2/PRT_DIS_P2) ; off-sheet USBA_P
NetJ18_2: J18.2 R267.1
NetJ18_3: J18.3 R268.1
NetJ19_2: J19.2 R279.1
NetJ19_3: J19.3 R283.1
NetR289_1: R289.1 U25.9(~{RST})
NetR290_1: R290.1 U25.8(VBUS)
NetR295_1: R295.1 R461.1 U25.20(RXD)
NetR316_1: R316.1 U25.21(TXD)
NetR389_1: R389.1 U25.1(~{RI}/CLK)
NetR403_2: R403.2 U32.35(RBIAS)
NetR405_2: R405.2 U32.24(SCL/SMBCLK/CFG_SEL0)
NetR406_2: R406.2 U32.22(SDA/SMBDATA/NON_REM1)
NetR460_1: R460.1 U25.11(GPIO.3/WAKEUP)
NetR545_2: R545.2 U32.28(SUSP_IND/LOCAL_PWR/NON_REM0)
NetR546_2: R546.2 U32.25(HS_IND/CFG_SEL1)
NetR550_1: R550.1 U25.22(~{DSR})
NetR551_1: R551.1 U25.24(~{DCD})
NetR637_1: R637.1 U25.18(~{CTS})
NetR639_2: R639.2 U32.27(VBUS_DET)

Not connected (* = marked no-connect by the designer): U25 12(GPIO.2/RS485)* 13(GPIO.1/RXT)* 14(GPIO.0/TXT)* 15(SUSPENDB)* 17(SUSPEND)* 19(~{RTS})* 23(~{DTR})*; U32 6(NC)* 7(NC)* 8(NC)* 9(NC)* 12(PRTPWR1/BC_EN1) 13(OCS_N1) 16(PRTPWR2/BC_EN2) 17(OCS_N2) 18(NC)* 19(NC)* 20(NC)* 21(NC)*

### Layout directives
differential pair; differential pair class DIFF90: IF_USB_N, IF_USB_P, USB_CONSOLE_N, USB_CONSOLE_P

### Notes on the sheet
- (near JP16) Reset button
- Project:
- Sub-system:
- Design by:
- Sheet title:
- Sheet
- of
- Checked by:
- Approved by:
- Revision:
- Document No:
- Size:
- Date:
- A3

### Library data of the parts
C122 C140 C141 C160 C205 C207 = _CAP_C_2: CAP
C345 C364 C375 = _CAP_C_High_2: CAP CHIP High Value
C365 C366 C371-C374 C376 C377 C393 C399-C401 = _CAP_C_2: CAP CHIP
FB2 = _IND
J18 J19 = Header 4x1_2M
JP16 = JUMPER_1_1
R244-R247 R267 R268 R279 R283 R289 R290 R295 R316 R389 R403-R406 R460 R461 R545-R547 R550 R551 R637 R639 = _RES_B_2: RES
U25 = IC_USB_toUART_CP2102N-A02-GQFN24R: Value: *; MP: CP2102N-A02-GQFN24R; Package: None; Availability: Unavailable; Price: None
U32 = IC_USB_HUB_USB2512BI-AEZG: Description; Manufacturer_Name: Microchip; Copyright: Copyright (C) 2026 Ultra Librarian. All rights reserved.; Manufacturer_Part_Number: USB2512BI-AEZG; RefDes: RefDes; Type: Type
Y7 = OSC1047: Crystal; Manufacturer 1: Abracon Corporation; Description_: CRYSTAL 24MHz 18pF SMD ABM8G; Dev Tools Status: Production; Owner: Mark Loper; Populated: DNP; MCHP-ID: OSC1047; Revision: 1; Symbol: Crystal 4 Pins; Status: MCL Design; ComponentLink1URL: https://chn-vm-apps.microchip.com/mchprepo/parts/Datasheets/ABM8G.pdf; ComponentLink1Description: SVN Datasheet; ComponentLink2URL: C:\ALTIUM_WORK\00001_MCHP-CDB\Datasheets\ABM8G.pdf; ComponentLink2Description: Local Datasheet; ComponentLink3URL: C:\ALTIUM_WORK\00001_MCHP-CDB\Library\LibraryRefs\Crystal 4 Pins.SchLib; ComponentLink3Description: Open Symbol; ComponentLink4URL: C:\ALTIUM_WORK\00001_MCHP-CDB\Library\Footprints\CRYSTAL_ABM8G.PcbLib; ComponentLink4Description: Open Footprint; ComponentLink5Description: Open Footprint 2; ComponentLink6Description: Open Footprint 3; ComponentLink7Description: Open Footprint 4; Package: ABM8G; Type: Crystal; Category: Crystal/Oscillator; Supplier 1: Digi-Key; Supplier Part Number 1: 535-10273-1-ND; Quantity Override: 1

## Sheet 13_MRAM_RTC_WDT.SchDoc
size 420 x 297 mm; SheetNumber: 22; SheetTotal: 36
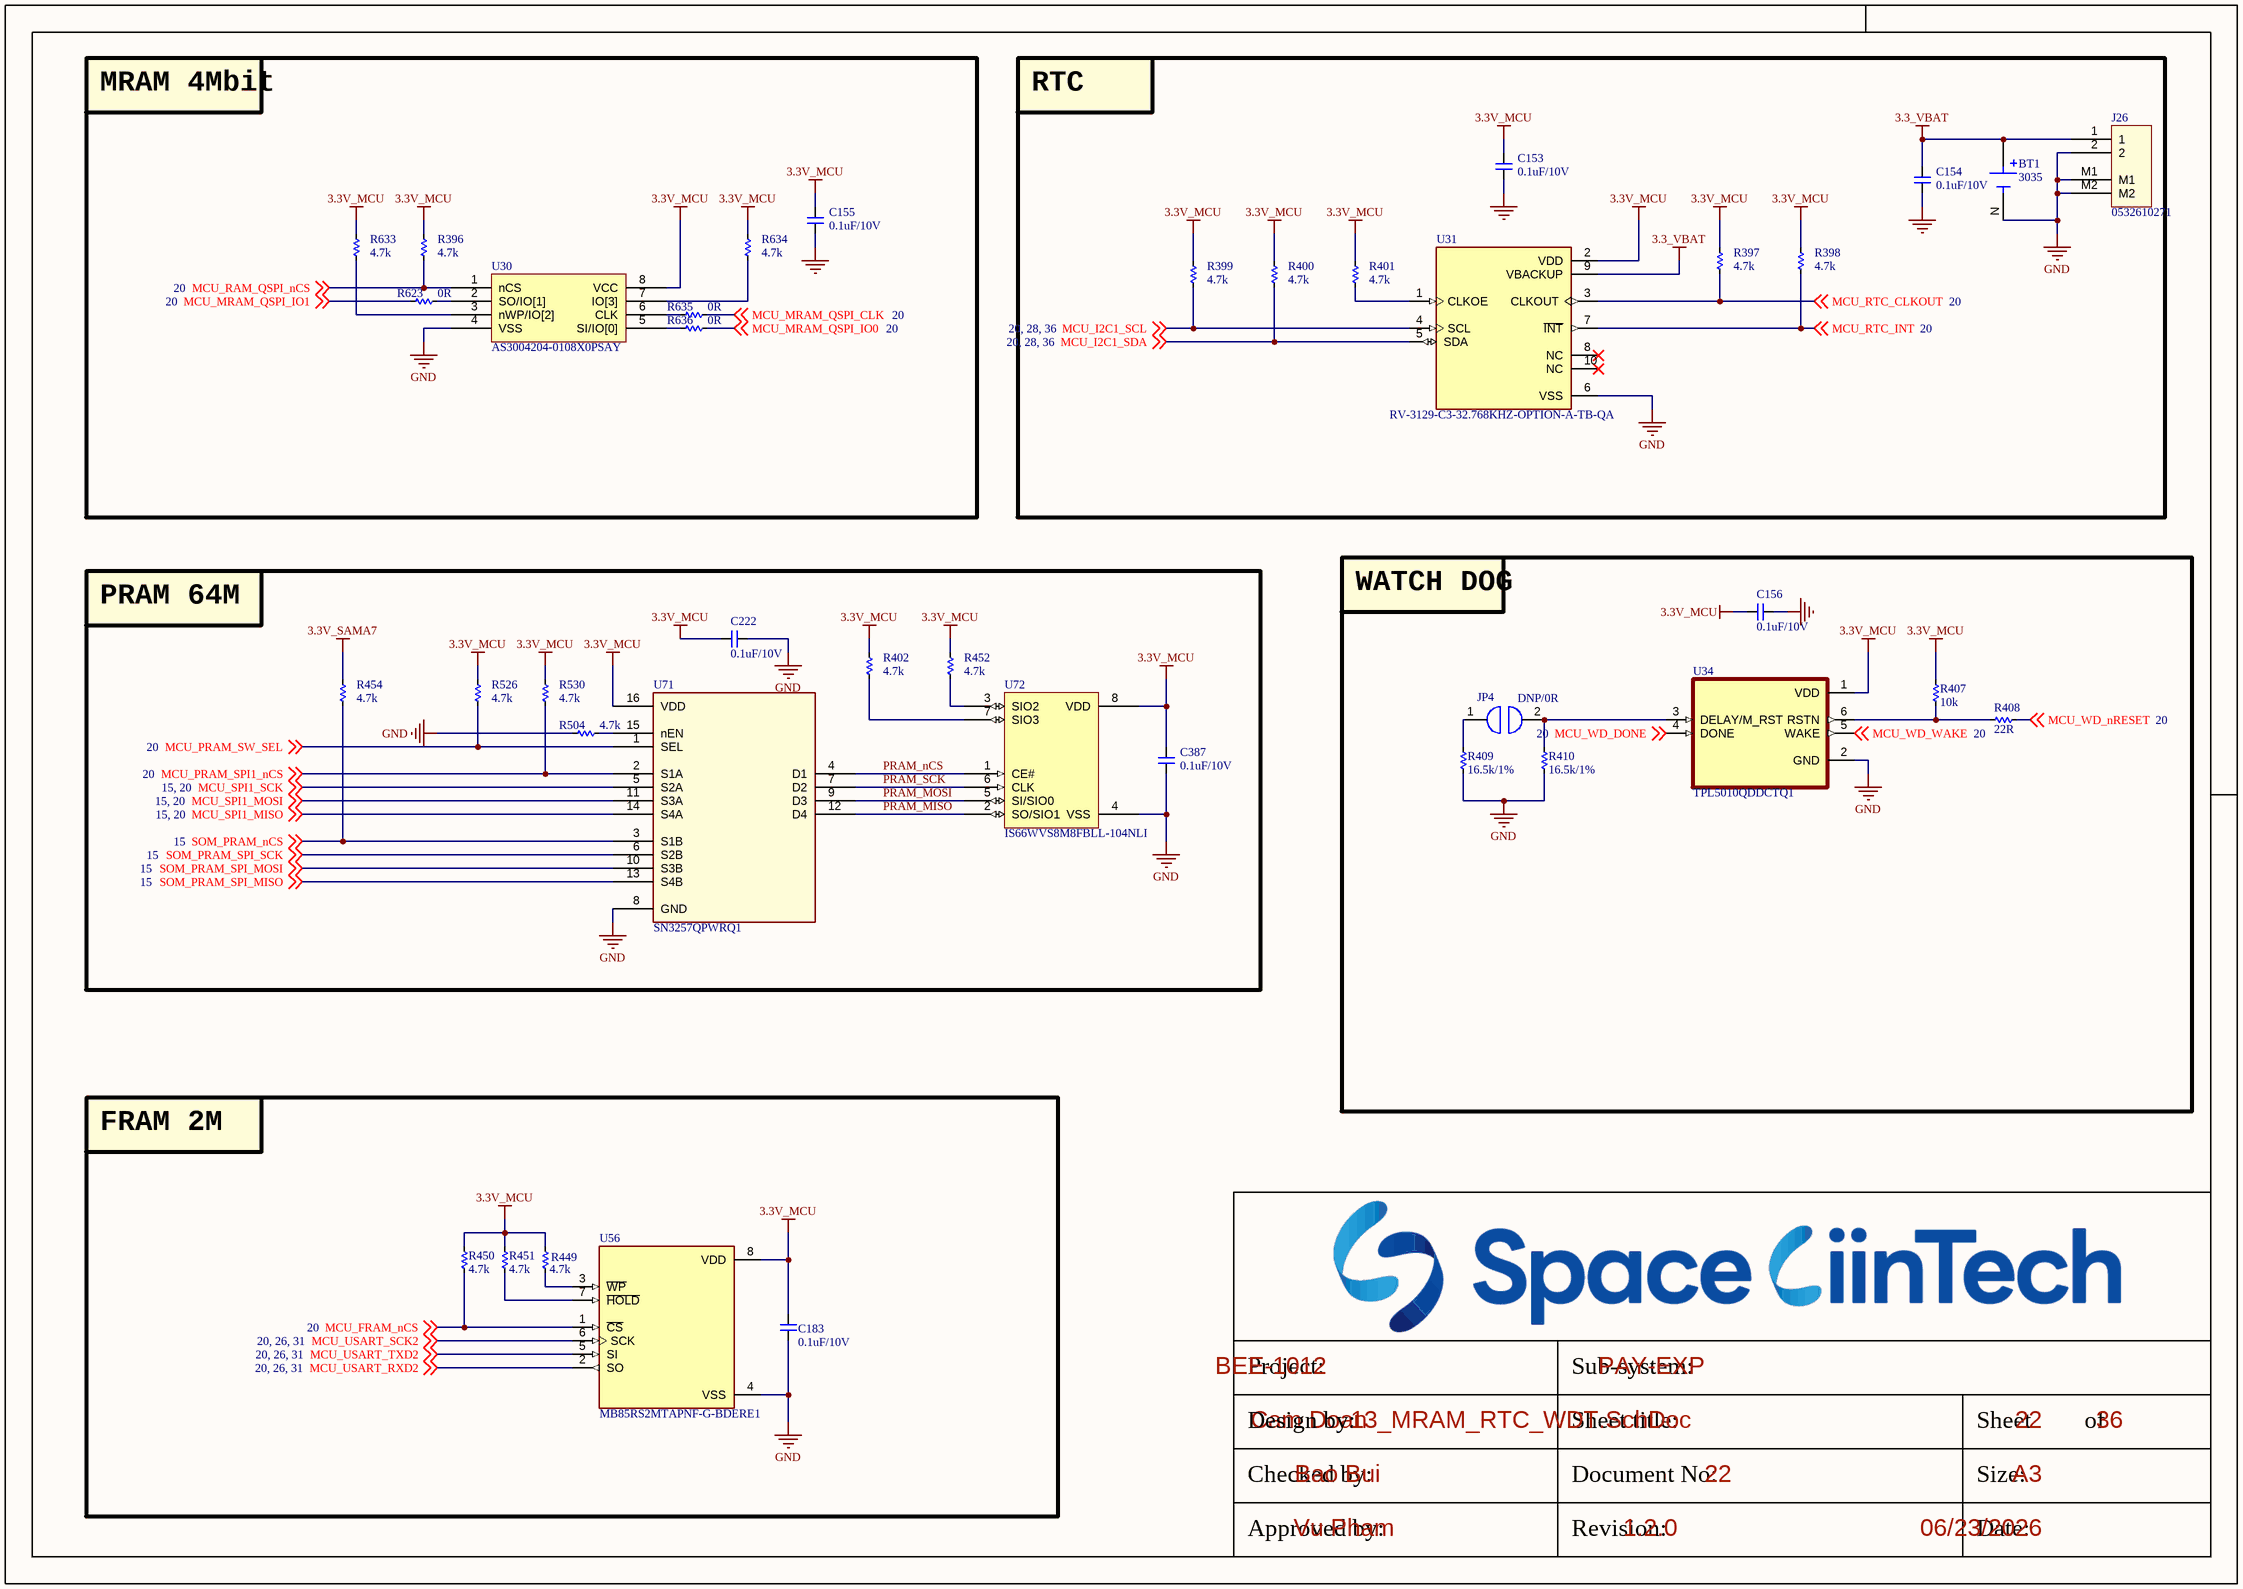
[diagram p23: 13_MRAM_RTC_WDT.SchDoc]

### Parts
BT1  3035  [BAT_3035]
C153  0.1uF/10V  [CAP_C_1005X60]
C154  0.1uF/10V  [CAP_C_1005X60]
C155  0.1uF/10V  [CAP_C_1005X60]
C156  0.1uF/10V  [CAP_C_1005X60]
C183  0.1uF/10V  [CAP_C_1005X60]
C222  0.1uF/10V  [CAP_C_1005X60]
C387  0.1uF/10V  [CAP_C_1005X60]
J26  0532610271  [molex_0532610271]
JP4  DNP/0R  [JUMPER_1608]
R396  4.7k  [RES_C_1005X40]
R397  4.7k  [RES_C_1005X40]
R398  4.7k  [RES_C_1005X40]
R399  4.7k  [RES_C_1005X40]
R400  4.7k  [RES_C_1005X40]
R401  4.7k  [RES_C_1005X40]
R402  4.7k  [RES_C_1005X40]
R407  10k  [RES_C_1005X40]
R408  22R  [RES_C_1005X40]
R409  16.5k/1%  [RES_C_1005X40]
R410  16.5k/1%  [RES_C_1005X40]
R449  4.7k  [RES_C_1005X40]
R450  4.7k  [RES_C_1005X40]
R451  4.7k  [RES_C_1005X40]
R452  4.7k  [RES_C_1005X40]
R454  4.7k  [RES_C_1005X40]
R504  4.7k  [RES_C_1005X40]
R526  4.7k  [RES_C_1005X40]
R530  4.7k  [RES_C_1005X40]
R623  0R  [RES_C_1005X40]
R633  4.7k  [RES_C_1005X40]
R634  4.7k  [RES_C_1005X40]
R635  0R  [RES_C_1005X40]
R636  0R  [RES_C_1005X40]
U30  AS3004204-0108X0PSAY  [SOIC127P790X216-8]
U31  RV-3129-C3-32.768KHZ-OPTION-A-TB-QA  [IC_RV-3129-C3_32.768KHZ_OPTION_A_TB_QA]
U34  TPL5010QDDCTQ1  [SOT95P280X145-6N]
U56  MB85RS2MTAPNF-G-BDERE1  [SOIC127P602X173-8N]
U71  SN3257QPWRQ1  [SOIC_PRQ1_TEX]
U72  IS66WVS8M8FBLL-104NLI  [SOIC8_150MIL_N_ISI]

### Blocks framed on the sheet
MRAM 4Mbit: C155 R396 R623 R633-R636 U30
RTC: BT1 C153 C154 J26 R397-R401 U31
PRAM 64M: C222 C387 R402 R452 R454 R504 R526 R530 U71 U72
WATCH DOG: C156 JP4 R407-R410 U34
FRAM 2M: C183 R449-R451 U56

### Nets
3.3_VBAT: BT1.P1(POS) BT1.P2(POS) C154.2 J26.1 U31.9(VBACKUP)
3.3V_MCU: C153.2 C155.2 C156.2 C183.2 C222.1 C387.1 R396.2 R397.2 R398.2 R399.2 R400.2 R401.1 R402.2 R407.2 R449.2 R450.2 R451.2 R452.2 R526.2 R530.2 R633.2 R634.2 U30.8(VCC) U31.2(VDD) U34.1(VDD) U56.8(VDD) U71.16(VDD) U72.8(VDD)
3.3V_SAMA7: R454.2
GND: BT1.N(NEG) C153.1 C154.1 C155.1 C156.1 C183.1 C222.2 C387.2 J26.2 J26.M1 J26.M2 R409.1 R410.1 R504.2 U30.4(VSS) U31.6(VSS) U34.2(GND) U56.4(VSS) U71.8(GND) U72.4(VSS)
MCU_FRAM_nCS: R450.1 U56.1(~{CS}) ; off-sheet MCU_FRAM_nCS
MCU_I2C1_SCL: R399.1 U31.4(SCL) ; off-sheet MCU_I2C1_SCL
MCU_I2C1_SDA: R400.1 U31.5(SDA) ; off-sheet MCU_I2C1_SDA
MCU_MRAM_QSPI_CLK: R635.1 ; off-sheet MCU_MRAM_QSPI_CLK
MCU_MRAM_QSPI_IO0: R636.1 ; off-sheet MCU_MRAM_QSPI_IO0
MCU_MRAM_QSPI_IO1: R623.2 ; off-sheet MCU_MRAM_QSPI_IO1
MCU_PRAM_SPI1_nCS: R530.1 U71.2(S1A) ; off-sheet MCU_PRAM_SPI1_nCS
MCU_PRAM_SW_SEL: R526.1 U71.1(SEL) ; off-sheet MCU_PRAM_SW_SEL
MCU_RAM_QSPI_nCS: R396.1 U30.1(nCS) ; off-sheet MCU_RAM_QSPI_nCS
MCU_RTC_CLKOUT: R397.1 U31.3(CLKOUT) ; off-sheet MCU_RTC_CLKOUT
MCU_RTC_INT: R398.1 U31.7(~{INT}) ; off-sheet MCU_RTC_INT
MCU_SPI1_MISO: U71.14(S4A) ; off-sheet MCU_SPI1_MISO
MCU_SPI1_MOSI: U71.11(S3A) ; off-sheet MCU_SPI1_MOSI
MCU_SPI1_SCK: U71.5(S2A) ; off-sheet MCU_SPI1_SCK
MCU_USART_RXD2: U56.2(SO) ; off-sheet MCU_USART_RXD2
MCU_USART_SCK2: U56.6(SCK) ; off-sheet MCU_USART_SCK2
MCU_USART_TXD2: U56.5(SI) ; off-sheet MCU_USART_TXD2
MCU_WD_DONE: U34.4(DONE) ; off-sheet MCU_WD_DONE
MCU_WD_nRESET: R408.1 ; off-sheet MCU_WD_nRESET
MCU_WD_WAKE: U34.5(WAKE) ; off-sheet MCU_WD_WAKE
PRAM_MISO: U71.12(D4) U72.2(SO/SIO1)
PRAM_MOSI: U71.9(D3) U72.5(SI/SIO0)
PRAM_nCS: U71.4(D1) U72.1(CE#)
PRAM_SCK: U71.7(D2) U72.6(CLK)
SOM_PRAM_nCS: R454.1 U71.3(S1B) ; off-sheet SOM_PRAM_nCS
SOM_PRAM_SPI_MISO: U71.13(S4B) ; off-sheet SOM_PRAM_SPI_MISO
SOM_PRAM_SPI_MOSI: U71.10(S3B) ; off-sheet SOM_PRAM_SPI_MOSI
SOM_PRAM_SPI_SCK: U71.6(S2B) ; off-sheet SOM_PRAM_SPI_SCK
NetJP4_1: JP4.1 R409.2
NetJP4_2: JP4.2 R410.2 U34.3(DELAY/M_RST)
NetR401_2: R401.2 U31.1(CLKOE)
NetR402_1: R402.1 U72.7(SIO3)
NetR407_1: R407.1 R408.2 U34.6(RSTN)
NetR449_1: R449.1 U56.3(~{WP})
NetR451_1: R451.1 U56.7(~{HOLD})
NetR452_1: R452.1 U72.3(SIO2)
NetR504_1: R504.1 U71.15(nEN)
NetR623_1: R623.1 U30.2(SO/IO[1])
NetR633_1: R633.1 U30.3(nWP/IO[2])
NetR634_1: R634.1 U30.7(IO[3])
NetR635_2: R635.2 U30.6(CLK)
NetR636_2: R636.2 U30.5(SI/IO[0])

Not connected (* = marked no-connect by the designer): U31 8(NC)* 10(NC)*

### Notes on the sheet
- Project:
- Sub-system:
- Design by:
- Sheet title:
- Sheet
- of
- Checked by:
- Approved by:
- Revision:
- Document No:
- Size:
- Date:
- A3

### Library data of the parts
BT1 = BT_HOLDER_3035: Battery Clip; THM; 20mm Cell; PhosBronze/Nickel | Keystone Electronics 3035; SnapEDA_Link: https://www.snapeda.com/parts/3035/Keystone/view-part/?ref=snap; Package: None; Value: *; MF: Keystone Electronics; MP: 3035; Check_prices: https://www.snapeda.com/parts/3035/Keystone/view-part/?ref=eda
C153-C156 C222 C387 = _CAP_C_2: CAP
C183 = _CAP_C_2: CAP CHIP
J26 = Header 2x1_2M
JP4 = JUMPER
R396-R402 R407-R410 R449-R452 R454 R504 R526 R530 R623 R633-R636 = _RES_B_2: RES
U30 = IC_RAM_AS3004204-0108X0PSAY
U31 = RV-3129-C3_32.768KHZ_OPTION_A_TB_QA: Real-Time Clock Module, Temperature compensated, in 2.5 x 3.7 mm package; MF: Micro Crystal; MP: RV-3129-C3 32.768KHZ OPTION A TB QA; SnapEDA_Link: https://www.snapeda.com/parts/RV-3129-C3%2032.768KHZ%20OPTION%20A%20TB%20QA/Micro+Crystal/view-part/?ref=snap; Package: QFN-10 Micro Crystal; Value: *; Check_prices: https://www.snapeda.com/parts/RV-3129-C3%2032.768KHZ%20OPTION%20A%20TB%20QA/Micro+Crystal/view-part/?ref=eda
U56 = MB85RS2MTAPNF-G-BDERE1: FRAM _Ferroelectric RAM_ Memory IC 2Mb _256K x 8_ SPI 40MHz 8-SOP; MF: Fujitsu Electronics; Package: SO-8 Fujitsu; Value: *; Digi-Key_Purchase_URL: https://www.digikey.com/product-detail/en/fujitsu-electronics-america-inc/MB85RS2MTAPNF-G-BDERE1/865-1286-1-ND/7916252?utm_source=snapeda&utm_medium=aggregator&utm_campaign=symbol; Digi-Key_Part_Number: 865-1286-1-ND; SnapEDA_Link: https://www.snapeda.com/parts/MB85RS2MTAPNF-G-BDERE1/Fujitsu%20Electronics%20America%2C%20Inc./view-part/2344795/?ref=snap; MP: MB85RS2MTAPNF-G-BDERE1
U71 = IC_SW_SPI_SN3257QPWRQ1: Automotive 5-V, 2:1 (SPDT), 4-channel switch with 1.8-V logic and powered-off protection 16-TSSOP -40 to 125; Manufacturer_Name: Texas Instruments; Copyright: Copyright (C) 2025 Ultra Librarian. All rights reserved.; Manufacturer_Part_Number: SN3257QPWRQ1; Datasheet: https://www.ti.com/lit/gpn/sn3257-q1; RefDes: RefDes; Type: Type
U72 = IS66WVS4M8BLL-104NLI: No Description Available; Manufacturer_Name: ISSI; Type: Memory; Copyright: Copyright (C) 2025 Ultra Librarian. All rights reserved.; Manufacturer_Part_Number: IS66WVS4M8BLL-104NLI; RefDes: RefDes
U34 = TPL5010QDDCTQ1: Package: None; Price: None; Value: *; MP: TPL5010QDDCTQ1; Availability: Unavailable

## Sheet 13_PRAM.SchDoc
size 420 x 297 mm; SheetNumber: 23; SheetTotal: 36

### Notes on the sheet
- Project:
- Sub-system:
- Design by:
- Sheet title:
- Sheet
- of
- Checked by:
- Approved by:
- Revision:
- Document No:
- Size:
- Date:
- A3

## Sheet 14_NTC_TEMPSENSOR.SchDoc
size 420 x 297 mm; SheetNumber: 24; SheetTotal: 36
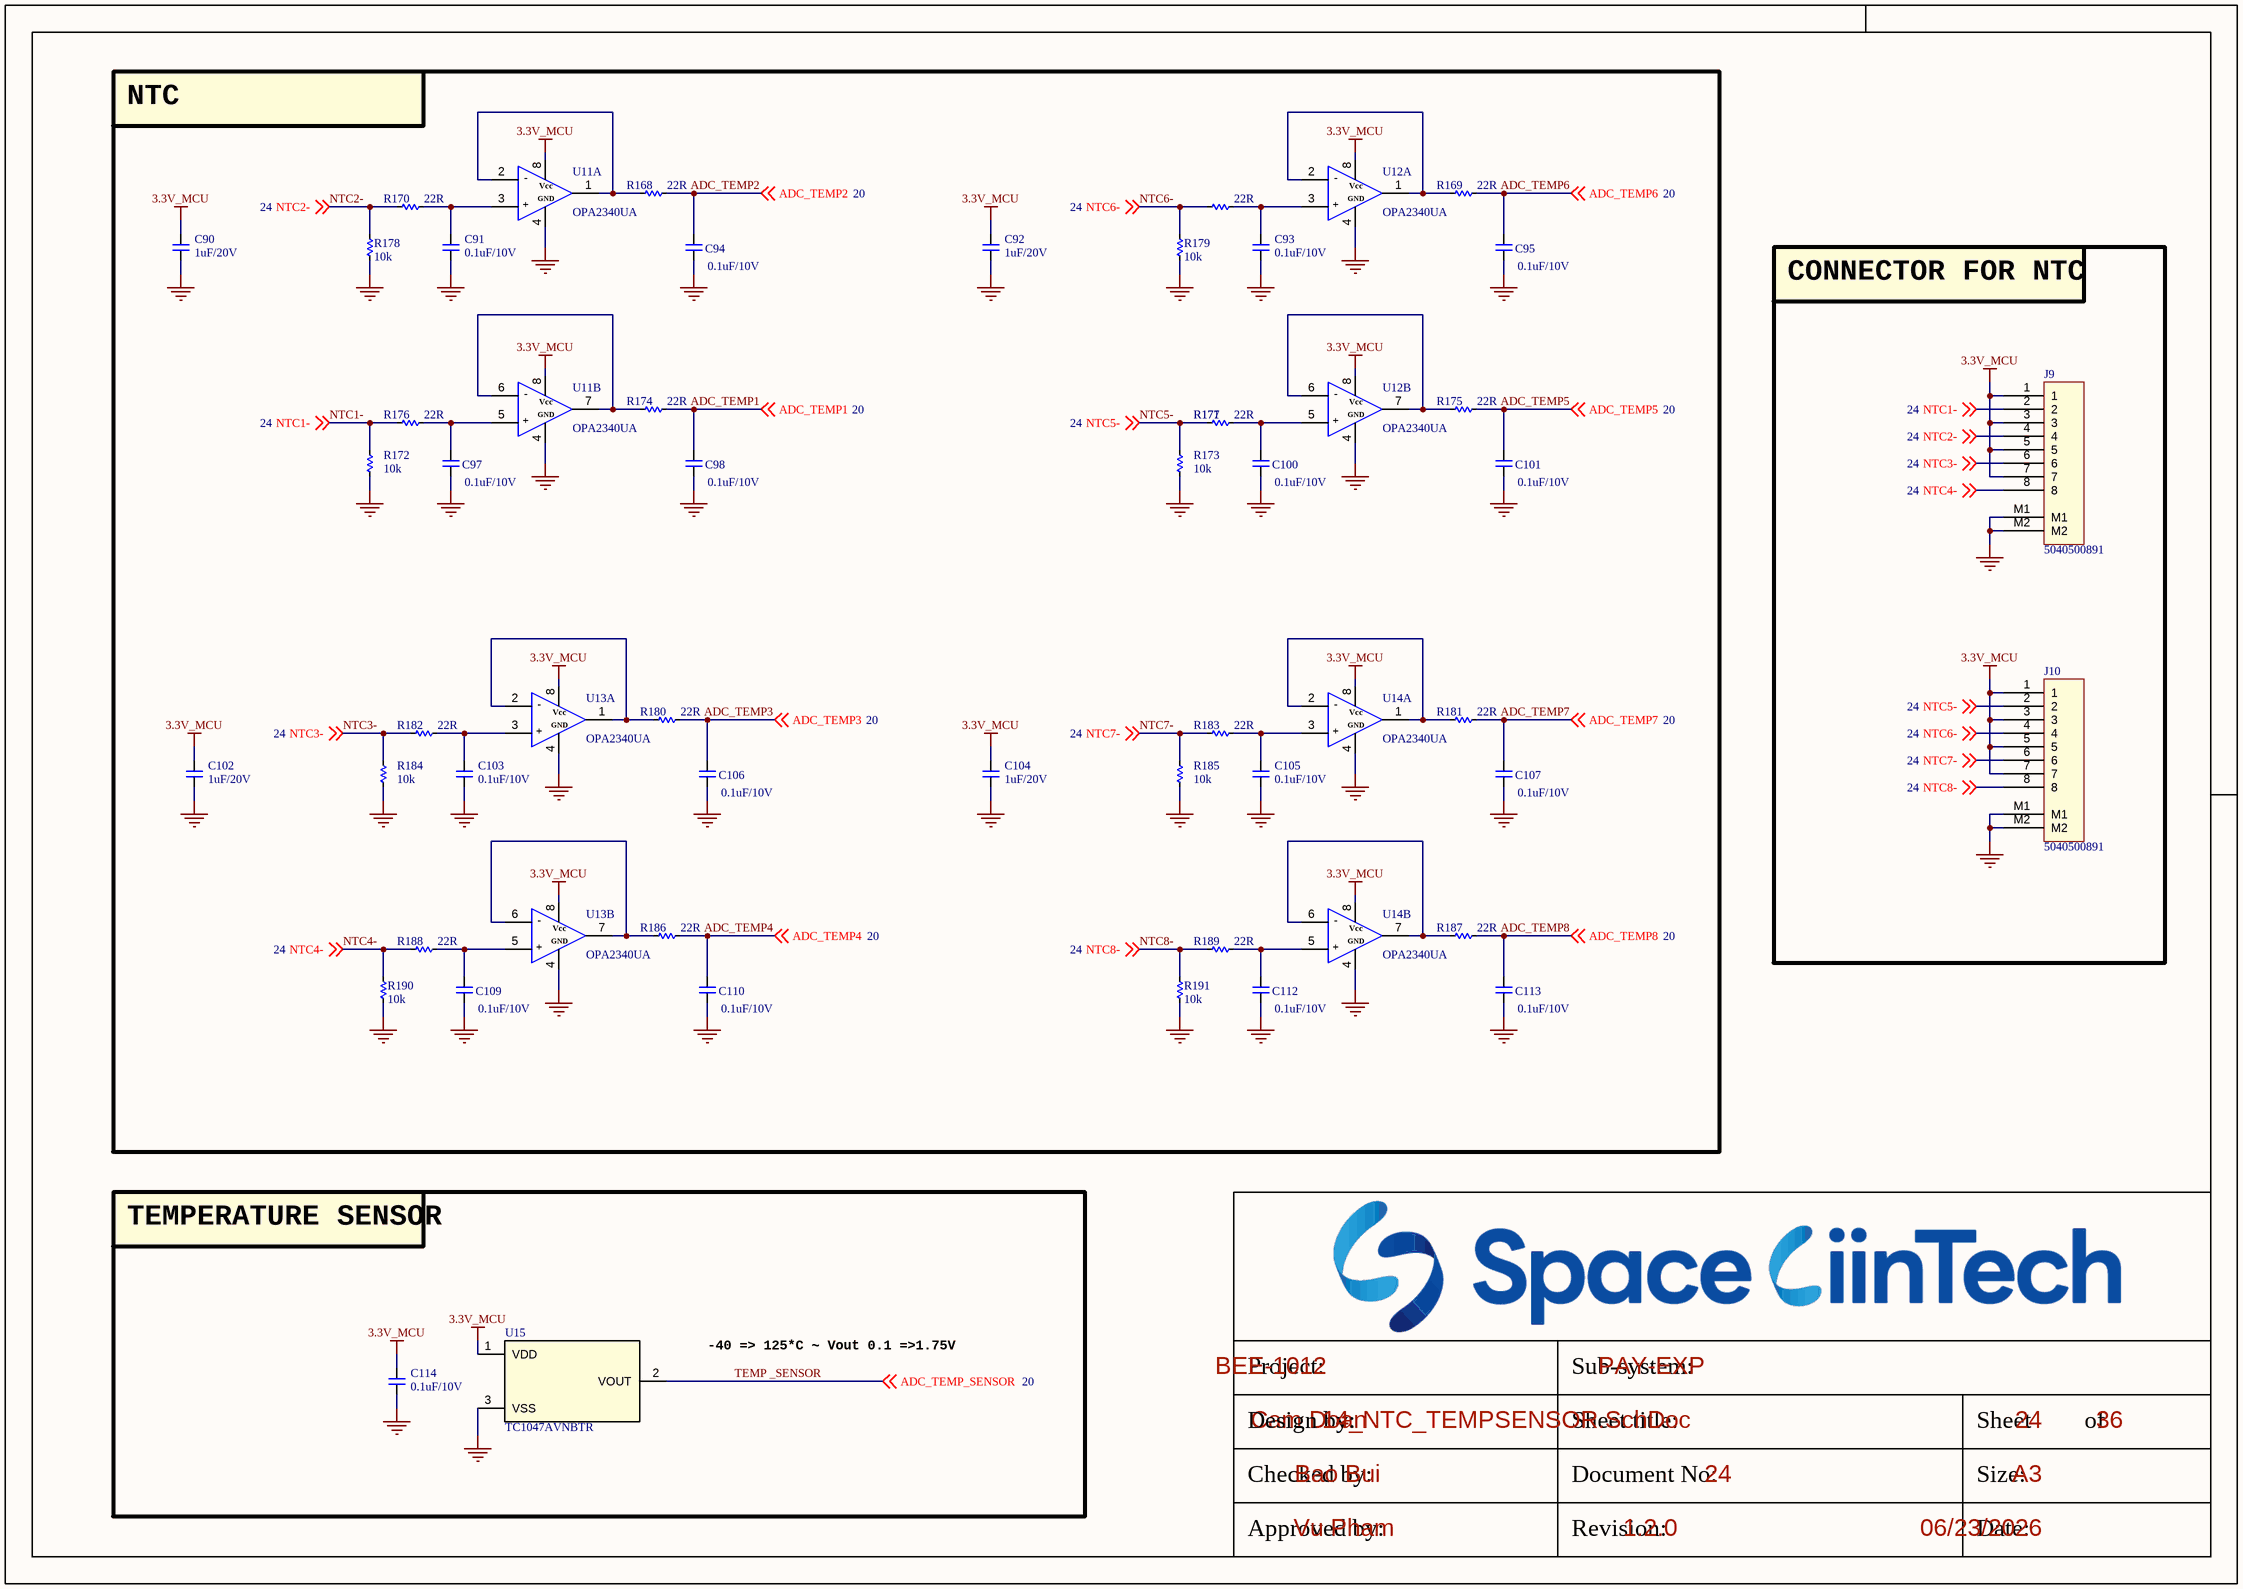
[diagram p24: 14_NTC_TEMPSENSOR.SchDoc]

### Parts
C90  1uF/20V  [CAP_C_1005X60]
C91  0.1uF/10V  [CAP_C_1005X60]
C92  1uF/20V  [CAP_C_1005X60]
C93  0.1uF/10V  [CAP_C_1005X60]
C94  0.1uF/10V  [CAP_C_1005X60]
C95  0.1uF/10V  [CAP_C_1005X60]
C97  0.1uF/10V  [CAP_C_1005X60]
C98  0.1uF/10V  [CAP_C_1005X60]
C100  0.1uF/10V  [CAP_C_1005X60]
C101  0.1uF/10V  [CAP_C_1005X60]
C102  1uF/20V  [CAP_C_1005X60]
C103  0.1uF/10V  [CAP_C_1005X60]
C104  1uF/20V  [CAP_C_1005X60]
C105  0.1uF/10V  [CAP_C_1005X60]
C106  0.1uF/10V  [CAP_C_1005X60]
C107  0.1uF/10V  [CAP_C_1005X60]
C109  0.1uF/10V  [CAP_C_1005X60]
C110  0.1uF/10V  [CAP_C_1005X60]
C112  0.1uF/10V  [CAP_C_1005X60]
C113  0.1uF/10V  [CAP_C_1005X60]
C114  0.1uF/10V  [CAP_C_1005X60]
J9  5040500891  [MOLEX_5040500891]
J10  5040500891  [MOLEX_5040500891]
R168  22R  [RES_C_1005X40]
R169  22R  [RES_C_1005X40]
R170  22R  [RES_C_1005X40]
R171  22R  [RES_C_1005X40]
R172  10k  [RES_C_1005X40]
R173  10k  [RES_C_1005X40]
R174  22R  [RES_C_1005X40]
R175  22R  [RES_C_1005X40]
R176  22R  [RES_C_1005X40]
R177  22R  [RES_C_1005X40]
R178  10k  [RES_C_1005X40]
R179  10k  [RES_C_1005X40]
R180  22R  [RES_C_1005X40]
R181  22R  [RES_C_1005X40]
R182  22R  [RES_C_1005X40]
R183  22R  [RES_C_1005X40]
R184  10k  [RES_C_1005X40]
R185  10k  [RES_C_1005X40]
R186  22R  [RES_C_1005X40]
R187  22R  [RES_C_1005X40]
R188  22R  [RES_C_1005X40]
R189  22R  [RES_C_1005X40]
R190  10k  [RES_C_1005X40]
R191  10k  [RES_C_1005X40]
U11  OPA2340UA  [SOIC127P602X173-8N]  (parts A,B of 2)
U12  OPA2340UA  [SOIC127P602X173-8N]  (parts A,B of 2)
U13  OPA2340UA  [SOIC127P602X173-8N]  (parts A,B of 2)
U14  OPA2340UA  [SOIC127P602X173-8N]  (parts A,B of 2)
U15  TC1047AVNBTR  [SOT95P240X120-3N]

### Blocks framed on the sheet
NTC: C90-C95 C97 C98 C100-C107 C109 C110 C112 C113 R168-R191 U11-U14
CONNECTOR FOR NTC: J9 J10
TEMPERATURE SENSOR: C114 U15

### Nets
3.3V_MCU: C90.2 C92.2 C102.2 C104.2 C114.2 J9.1 J9.3 J9.5 J9.7 J10.1 J10.3 J10.5 J10.7 U11.8 U12.8 U13.8 U14.8 U15.1(VDD)
GND: C90.1 C91.1 C92.1 C93.1 C94.1 C95.1 C97.1 C98.1 C100.1 C101.1 C102.1 C103.1 C104.1 C105.1 C106.1 C107.1 C109.1 C110.1 C112.1 C113.1 C114.1 J9.M1 J9.M2 J10.M1 J10.M2 R172.1 R173.1 R178.1 R179.1 R184.1 R185.1 R190.1 R191.1 U11.4 U12.4 U13.4 U14.4 U15.3(VSS)
ADC_TEMP1: C98.2 R174.2 ; off-sheet ADC_TEMP1
ADC_TEMP2: C94.2 R168.2 ; off-sheet ADC_TEMP2
ADC_TEMP3: C106.2 R180.2 ; off-sheet ADC_TEMP3
ADC_TEMP4: C110.2 R186.2 ; off-sheet ADC_TEMP4
ADC_TEMP5: C101.2 R175.2 ; off-sheet ADC_TEMP5
ADC_TEMP6: C95.2 R169.2 ; off-sheet ADC_TEMP6
ADC_TEMP7: C107.2 R181.2 ; off-sheet ADC_TEMP7
ADC_TEMP8: C113.2 R187.2 ; off-sheet ADC_TEMP8
NTC1-: J9.2 R172.2 R176.1 ; off-sheet NTC1-
NTC2-: J9.4 R170.1 R178.2 ; off-sheet NTC2-
NTC3-: J9.6 R182.1 R184.2 ; off-sheet NTC3-
NTC4-: J9.8 R188.1 R190.2 ; off-sheet NTC4-
NTC5-: J10.2 R173.2 R177.1 ; off-sheet NTC5-
NTC6-: J10.4 R171.1 R179.2 ; off-sheet NTC6-
NTC7-: J10.6 R183.1 R185.2 ; off-sheet NTC7-
NTC8-: J10.8 R189.1 R191.2 ; off-sheet NTC8-
TEMP _SENSOR: U15.2(VOUT) ; off-sheet ADC_TEMP_SENSOR  [also labelled ADC_TEMP_SENSOR]
NetC91_2: C91.2 R170.2 U11.3
NetC93_2: C93.2 R171.2 U12.3
NetC97_2: C97.2 R176.2 U11.5
NetC100_2: C100.2 R177.2 U12.5
NetC103_2: C103.2 R182.2 U13.3
NetC105_2: C105.2 R183.2 U14.3
NetC109_2: C109.2 R188.2 U13.5
NetC112_2: C112.2 R189.2 U14.5
NetR168_1: R168.1 U11.1 U11.2
NetR169_1: R169.1 U12.1 U12.2
NetR174_1: R174.1 U11.6 U11.7
NetR175_1: R175.1 U12.6 U12.7
NetR180_1: R180.1 U13.1 U13.2
NetR181_1: R181.1 U14.1 U14.2
NetR186_1: R186.1 U13.6 U13.7
NetR187_1: R187.1 U14.6 U14.7

### Notes on the sheet
- -40 => 125*C ~ Vout 0.1 =>1.75V
- Project:
- Sub-system:
- Design by:
- Sheet title:
- Sheet
- of
- Checked by:
- Approved by:
- Revision:
- Document No:
- Size:
- Date:
- A3
- (in symbol OPA2340UA, part A) -; Vcc; GND; +
- (in symbol OPA2340UA, part B) -; Vcc; GND; +

### Library data of the parts
C90-C95 C97 C98 C100-C107 C109 C110 C112-C114 = _CAP_C_2: CAP
J9 J10 = Header 8x1_2M
R168-R191 = _RES_B_2: RES
U15 = IC_SENSOR_TC1047AVNBTR: Temperature Sensor Analog, Local -40°C ~ 125°C 10mV/°C SOT-23-3

## Sheet 15_HEATER.SchDoc
size 420 x 297 mm; SheetNumber: 25; SheetTotal: 36
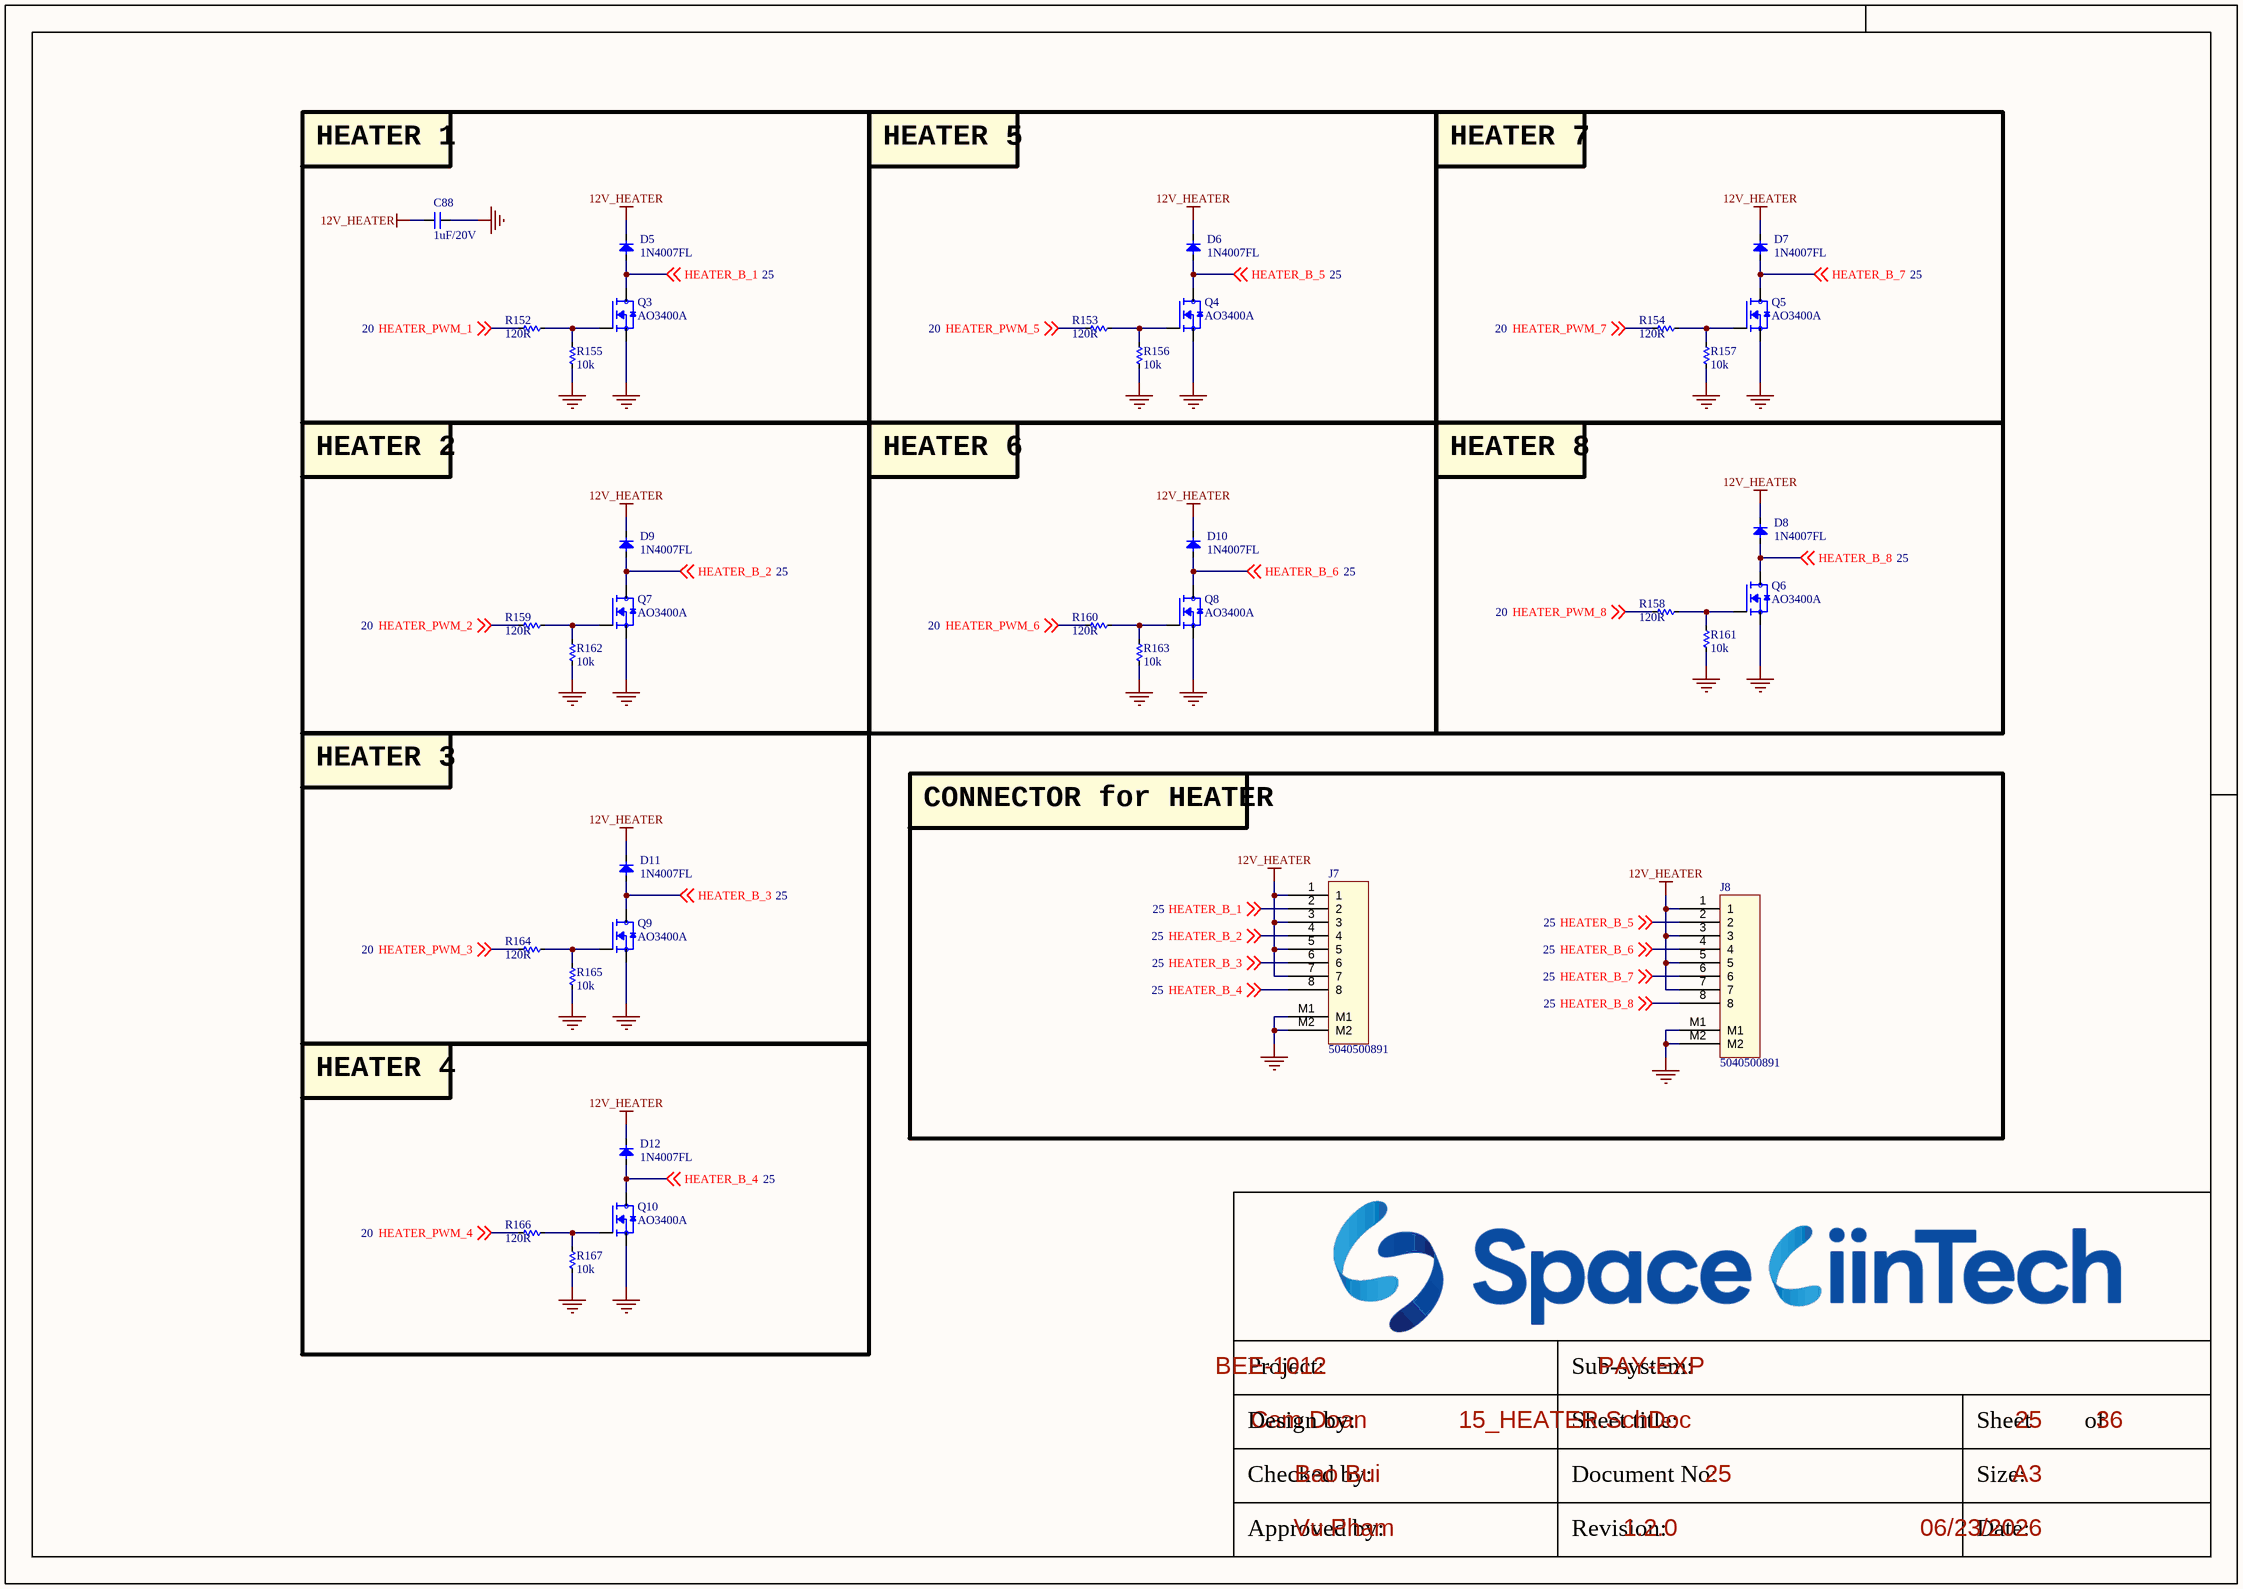
[diagram p25: 15_HEATER.SchDoc]

### Parts
C88  1uF/20V  [CAP_C_1005X60]
D5  1N4007FL  [SOD3717X145N]
D6  1N4007FL  [SOD3717X145N]
D7  1N4007FL  [SOD3717X145N]
D8  1N4007FL  [SOD3717X145N]
D9  1N4007FL  [SOD3717X145N]
D10  1N4007FL  [SOD3717X145N]
D11  1N4007FL  [SOD3717X145N]
D12  1N4007FL  [SOD3717X145N]
J7  5040500891  [MOLEX_5040500891]
J8  5040500891  [MOLEX_5040500891]
Q3  AO3400A  [SOT95P240X120-3N]
Q4  AO3400A  [SOT95P240X120-3N]
Q5  AO3400A  [SOT95P240X120-3N]
Q6  AO3400A  [SOT95P240X120-3N]
Q7  AO3400A  [SOT95P240X120-3N]
Q8  AO3400A  [SOT95P240X120-3N]
Q9  AO3400A  [SOT95P240X120-3N]
Q10  AO3400A  [SOT95P240X120-3N]
R152  120R  [RES_C_1005X40]
R153  120R  [RES_C_1005X40]
R154  120R  [RES_C_1005X40]
R155  10k  [RES_C_1005X40]
R156  10k  [RES_C_1005X40]
R157  10k  [RES_C_1005X40]
R158  120R  [RES_C_1005X40]
R159  120R  [RES_C_1005X40]
R160  120R  [RES_C_1005X40]
R161  10k  [RES_C_1005X40]
R162  10k  [RES_C_1005X40]
R163  10k  [RES_C_1005X40]
R164  120R  [RES_C_1005X40]
R165  10k  [RES_C_1005X40]
R166  120R  [RES_C_1005X40]
R167  10k  [RES_C_1005X40]

### Blocks framed on the sheet
HEATER 1: C88 D5 Q3 R152 R155
HEATER 5: D6 Q4 R153 R156
HEATER 7: D7 Q5 R154 R157
HEATER 2: D9 Q7 R159 R162
HEATER 6: D10 Q8 R160 R163
HEATER 8: D8 Q6 R158 R161
HEATER 3: D11 Q9 R164 R165
CONNECTOR for HEATER: J7 J8
HEATER 4: D12 Q10 R166 R167

### Nets
12V_HEATER: C88.2 D5.1(K) D6.1(K) D7.1(K) D8.1(K) D9.1(K) D10.1(K) D11.1(K) D12.1(K) J7.1 J7.3 J7.5 J7.7 J8.1 J8.3 J8.5 J8.7
GND: C88.1 J7.M1 J7.M2 J8.M1 J8.M2 Q3.2(S) Q4.2(S) Q5.2(S) Q6.2(S) Q7.2(S) Q8.2(S) Q9.2(S) Q10.2(S) R155.1 R156.1 R157.1 R161.1 R162.1 R163.1 R165.1 R167.1
HEATER_B_1: D5.2(A) J7.2 Q3.3(D) ; off-sheet HEATER_B_1
HEATER_B_2: D9.2(A) J7.4 Q7.3(D) ; off-sheet HEATER_B_2
HEATER_B_3: D11.2(A) J7.6 Q9.3(D) ; off-sheet HEATER_B_3
HEATER_B_4: D12.2(A) J7.8 Q10.3(D) ; off-sheet HEATER_B_4
HEATER_B_5: D6.2(A) J8.2 Q4.3(D) ; off-sheet HEATER_B_5
HEATER_B_6: D10.2(A) J8.4 Q8.3(D) ; off-sheet HEATER_B_6
HEATER_B_7: D7.2(A) J8.6 Q5.3(D) ; off-sheet HEATER_B_7
HEATER_B_8: D8.2(A) J8.8 Q6.3(D) ; off-sheet HEATER_B_8
HEATER_PWM_1: R152.1 ; off-sheet HEATER_PWM_1
HEATER_PWM_2: R159.1 ; off-sheet HEATER_PWM_2
HEATER_PWM_3: R164.1 ; off-sheet HEATER_PWM_3
HEATER_PWM_4: R166.1 ; off-sheet HEATER_PWM_4
HEATER_PWM_5: R153.1 ; off-sheet HEATER_PWM_5
HEATER_PWM_6: R160.1 ; off-sheet HEATER_PWM_6
HEATER_PWM_7: R154.1 ; off-sheet HEATER_PWM_7
HEATER_PWM_8: R158.1 ; off-sheet HEATER_PWM_8
NetQ3_1: Q3.1(G) R152.2 R155.2
NetQ4_1: Q4.1(G) R153.2 R156.2
NetQ5_1: Q5.1(G) R154.2 R157.2
NetQ6_1: Q6.1(G) R158.2 R161.2
NetQ7_1: Q7.1(G) R159.2 R162.2
NetQ8_1: Q8.1(G) R160.2 R163.2
NetQ9_1: Q9.1(G) R164.2 R165.2
NetQ10_1: Q10.1(G) R166.2 R167.2

### Notes on the sheet
- Project:
- Sub-system:
- Design by:
- Sheet title:
- Sheet
- of
- Checked by:
- Approved by:
- Revision:
- Document No:
- Size:
- Date:
- A3

### Library data of the parts
C88 = _CAP_C_2: CAP
D5-D12 = Diode SMD: Default Diode; Code - JEDEC: DO-214-AB; Value: 1N5007; Published: 8-Jun-2000; Revision: July-2002: Re-released for DXP Platform.; Publisher: Altium Limited
J7 J8 = Header 8x1_2M
Q3-Q10 = MOSFET_N: N-Channel 30 V 5.7A (Ta) 1.4W (Ta) Surface Mount SOT-23-3; MF: Alpha & Omega Semiconductor; SnapEDA_Link: https://www.snapeda.com/parts/AO3400A/Alpha/view-part/?ref=snap; Package: SOT-23 Alpha &amp; Omega Semiconductor Inc.; Value: *; MP: AO3400A; Check_prices: https://www.snapeda.com/parts/AO3400A/Alpha/view-part/?ref=eda
R152-R167 = _RES_B_2: RES

## Sheet 16_TEC.SchDoc
size 420 x 297 mm; SheetNumber: 26; SheetTotal: 36
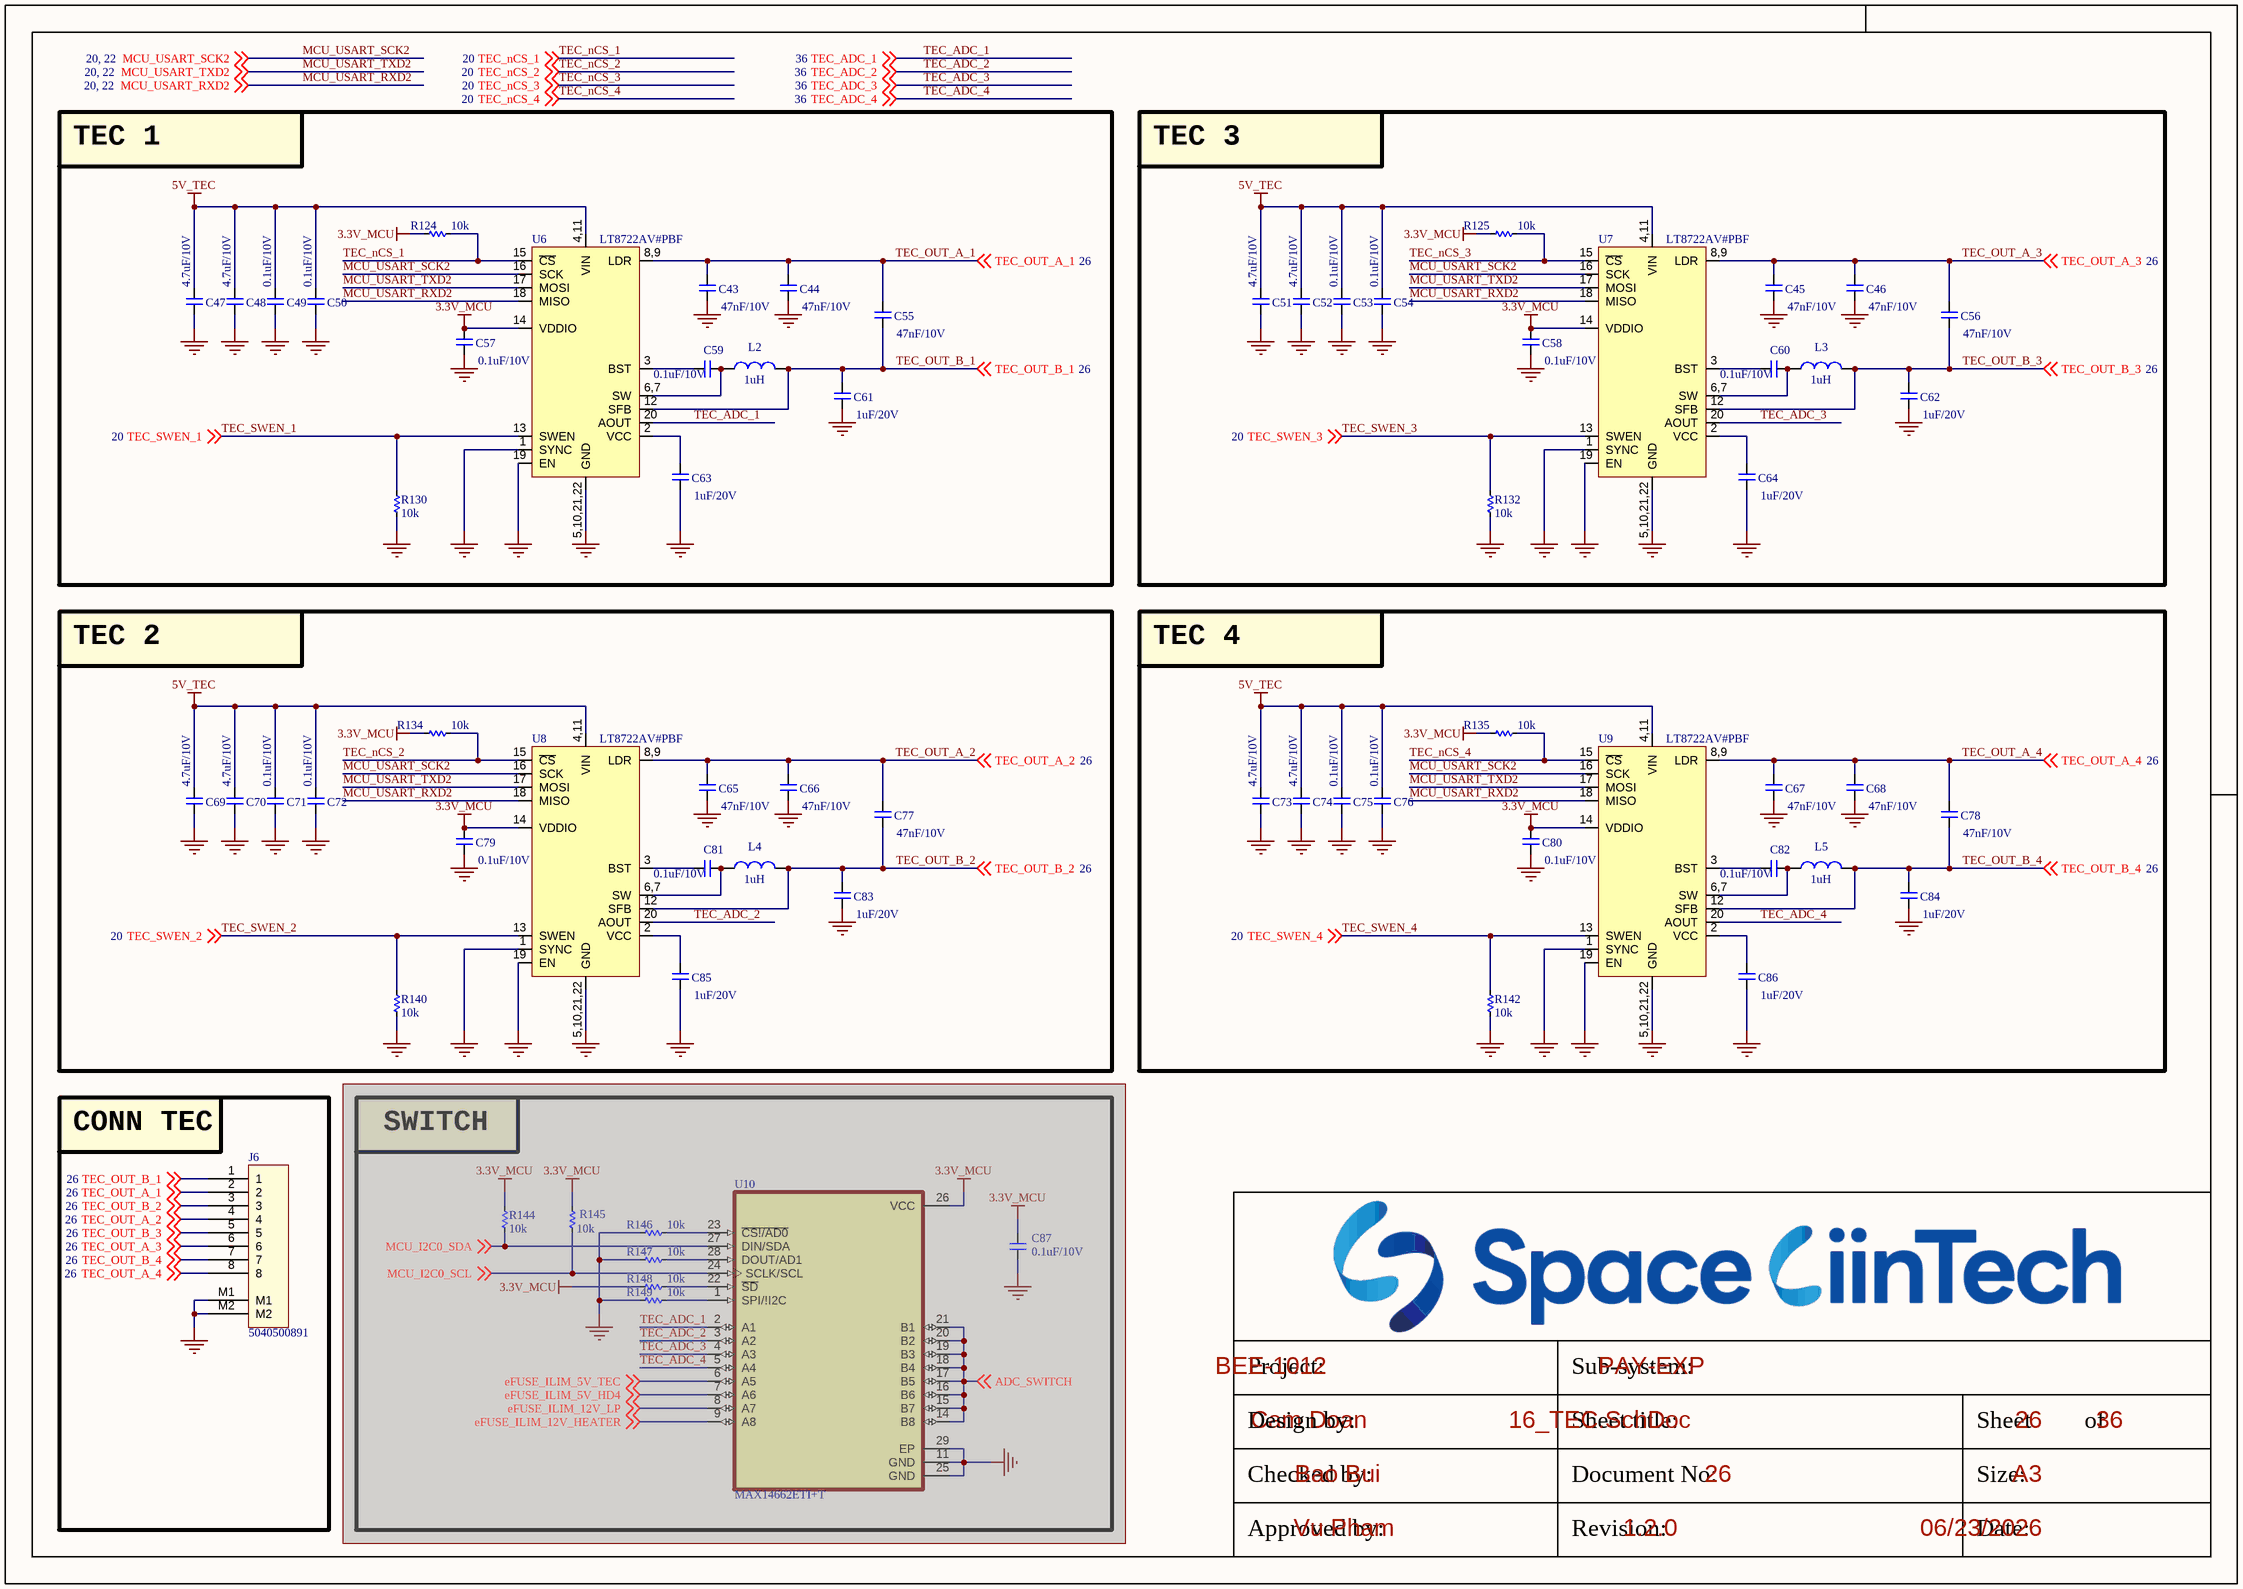
[diagram p26: 16_TEC.SchDoc]

### Parts
(Parts that share a designator on the sheet are numbered #1, #2 ... from top to bottom, then left to right.)
C43  47nF/10V  [CAP_C_1005X60]
C44  47nF/10V  [CAP_C_1005X60]
C45  47nF/10V  [CAP_C_1005X60]
C46  47nF/10V  [CAP_C_1005X60]
C47  4.7uF/10V  [CAP_C_1005X60]
C48  4.7uF/10V  [CAP_C_1005X60]
C49  0.1uF/10V  [CAP_C_1005X60]
C50  0.1uF/10V  [CAP_C_1005X60]
C51  4.7uF/10V  [CAP_C_1005X60]
C52  4.7uF/10V  [CAP_C_1005X60]
C53  0.1uF/10V  [CAP_C_1005X60]
C54  0.1uF/10V  [CAP_C_1005X60]
C55  47nF/10V  [CAP_C_1005X60]
C56  47nF/10V  [CAP_C_1005X60]
C57  0.1uF/10V  [CAP_C_1005X60]
C58  0.1uF/10V  [CAP_C_1005X60]
C59  0.1uF/10V  [CAP_C_1005X60]
C60  0.1uF/10V  [CAP_C_1005X60]
C61  1uF/20V  [CAP_C_1005X60]
C62  1uF/20V  [CAP_C_1005X60]
C63  1uF/20V  [CAP_C_1005X60]
C64  1uF/20V  [CAP_C_1005X60]
C65  47nF/10V  [CAP_C_1005X60]
C66  47nF/10V  [CAP_C_1005X60]
C67  47nF/10V  [CAP_C_1005X60]
C68  47nF/10V  [CAP_C_1005X60]
C69  4.7uF/10V  [CAP_C_1005X60]
C70  4.7uF/10V  [CAP_C_1005X60]
C71  0.1uF/10V  [CAP_C_1005X60]
C72  0.1uF/10V  [CAP_C_1005X60]
C73  4.7uF/10V  [CAP_C_1005X60]
C74  4.7uF/10V  [CAP_C_1005X60]
C75  0.1uF/10V  [CAP_C_1005X60]
C76  0.1uF/10V  [CAP_C_1005X60]
C77  47nF/10V  [CAP_C_1005X60]
C78  47nF/10V  [CAP_C_1005X60]
C79  0.1uF/10V  [CAP_C_1005X60]
C80  0.1uF/10V  [CAP_C_1005X60]
C81  0.1uF/10V  [CAP_C_1005X60]
C82  0.1uF/10V  [CAP_C_1005X60]
C83  1uF/20V  [CAP_C_1005X60]
C84  1uF/20V  [CAP_C_1005X60]
C85  1uF/20V  [CAP_C_1005X60]
C86  1uF/20V  [CAP_C_1005X60]
C87#1  0.1uF/10V  [CAP_C_1005X60]  (masked out: inside a compile mask, not in the netlist)
J6  5040500891  [MOLEX_5040500891]
L2  1uH  [L-SMD-M-3.5x3.5x2mm]
L3  1uH  [L-SMD-M-3.5x3.5x2mm]
L4  1uH  [L-SMD-M-3.5x3.5x2mm]
L5  1uH  [L-SMD-M-3.5x3.5x2mm]
R124  10k  [RES_C_1005X40]
R125  10k  [RES_C_1005X40]
R130  10k  [RES_C_1005X40]
R132  10k  [RES_C_1005X40]
R134  10k  [RES_C_1005X40]
R135  10k  [RES_C_1005X40]
R140  10k  [RES_C_1005X40]
R142  10k  [RES_C_1005X40]
R144#1  10k  [RES_C_1005X40]  (masked out: inside a compile mask, not in the netlist)
R145#1  10k  [RES_C_1005X40]  (masked out: inside a compile mask, not in the netlist)
R146#1  10k  [RES_C_1005X40]  (masked out: inside a compile mask, not in the netlist)
R147#1  10k  [RES_C_1005X40]  (masked out: inside a compile mask, not in the netlist)
R148#1  10k  [RES_C_1005X40]  (masked out: inside a compile mask, not in the netlist)
R149#1  10k  [RES_C_1005X40]  (masked out: inside a compile mask, not in the netlist)
U6  LT8722AV#PBF  [QFN18]
U7  LT8722AV#PBF  [QFN18]
U8  LT8722AV#PBF  [QFN18]
U9  LT8722AV#PBF  [QFN18]
U10#1  MAX14662ETI+T  [QFN40P400X400X80-29N]  (masked out: inside a compile mask, not in the netlist)

### Blocks framed on the sheet
TEC 1: C43 C44 C47-C50 C55 C57 C59 C61 C63 L2 R124 R130 U6
TEC 3: C45 C46 C51-C54 C56 C58 C60 C62 C64 L3 R125 R132 U7
TEC 2: C65 C66 C69-C72 C77 C79 C81 C83 C85 L4 R134 R140 U8
TEC 4: C67 C68 C73-C76 C78 C80 C82 C84 C86 L5 R135 R142 U9
CONN TEC: J6
SWITCH: C87#1 R144#1 R145#1 R146#1 R147#1 R148#1 R149#1 U10#1

### Nets
3.3V_MCU: C57.2 C58.2 C79.2 C80.2 R124.1 R125.1 R134.1 R135.1 U6.14(VDDIO) U7.14(VDDIO) U8.14(VDDIO) U9.14(VDDIO)
5V_TEC: C47.2 C48.2 C49.2 C50.2 C51.2 C52.2 C53.2 C54.2 C69.2 C70.2 C71.2 C72.2 C73.2 C74.2 C75.2 C76.2 U6.4,11(VIN) U7.4,11(VIN) U8.4,11(VIN) U9.4,11(VIN)
GND: C43.1 C44.1 C45.1 C46.1 C47.1 C48.1 C49.1 C50.1 C51.1 C52.1 C53.1 C54.1 C57.1 C58.1 C61.1 C62.1 C63.1 C64.1 C65.1 C66.1 C67.1 C68.1 C69.1 C70.1 C71.1 C72.1 C73.1 C74.1 C75.1 C76.1 C79.1 C80.1 C83.1 C84.1 C85.1 C86.1 J6.M1 J6.M2 R130.2 R132.2 R140.2 R142.2 U6.1(SYNC) U6.5,10,21,22(GND) U6.19(EN) U7.1(SYNC) U7.5,10,21,22(GND) U7.19(EN) U8.1(SYNC) U8.5,10,21,22(GND) U8.19(EN) U9.1(SYNC) U9.5,10,21,22(GND) U9.19(EN)
MCU_USART_RXD2: U6.18(MISO) U7.18(MISO) U8.18(MISO) U9.18(MISO) ; off-sheet MCU_USART_RXD2
MCU_USART_SCK2: U6.16(SCK) U7.16(SCK) U8.16(SCK) U9.16(SCK) ; off-sheet MCU_USART_SCK2
MCU_USART_TXD2: U6.17(MOSI) U7.17(MOSI) U8.17(MOSI) U9.17(MOSI) ; off-sheet MCU_USART_TXD2
TEC_ADC_1: U6.20(AOUT) ; off-sheet TEC_ADC_1
TEC_ADC_2: U8.20(AOUT) ; off-sheet TEC_ADC_2
TEC_ADC_3: U7.20(AOUT) ; off-sheet TEC_ADC_3
TEC_ADC_4: U9.20(AOUT) ; off-sheet TEC_ADC_4
TEC_nCS_1: R124.2 U6.15(~{CS}) ; off-sheet TEC_nCS_1
TEC_nCS_2: R134.2 U8.15(~{CS}) ; off-sheet TEC_nCS_2
TEC_nCS_3: R125.2 U7.15(~{CS}) ; off-sheet TEC_nCS_3
TEC_nCS_4: R135.2 U9.15(~{CS}) ; off-sheet TEC_nCS_4
TEC_OUT_A_1: C43.2 C44.2 C55.2 J6.2 U6.8,9(LDR) ; off-sheet TEC_OUT_A_1
TEC_OUT_A_2: C65.2 C66.2 C77.2 J6.4 U8.8,9(LDR) ; off-sheet TEC_OUT_A_2
TEC_OUT_A_3: C45.2 C46.2 C56.2 J6.6 U7.8,9(LDR) ; off-sheet TEC_OUT_A_3
TEC_OUT_A_4: C67.2 C68.2 C78.2 J6.8 U9.8,9(LDR) ; off-sheet TEC_OUT_A_4
TEC_OUT_B_1: C55.1 C61.2 J6.1 L2.2 U6.12(SFB) ; off-sheet TEC_OUT_B_1
TEC_OUT_B_2: C77.1 C83.2 J6.3 L4.2 U8.12(SFB) ; off-sheet TEC_OUT_B_2
TEC_OUT_B_3: C56.1 C62.2 J6.5 L3.2 U7.12(SFB) ; off-sheet TEC_OUT_B_3
TEC_OUT_B_4: C78.1 C84.2 J6.7 L5.2 U9.12(SFB) ; off-sheet TEC_OUT_B_4
TEC_SWEN_1: R130.1 U6.13(SWEN) ; off-sheet TEC_SWEN_1
TEC_SWEN_2: R140.1 U8.13(SWEN) ; off-sheet TEC_SWEN_2
TEC_SWEN_3: R132.1 U7.13(SWEN) ; off-sheet TEC_SWEN_3
TEC_SWEN_4: R142.1 U9.13(SWEN) ; off-sheet TEC_SWEN_4
NetC59_1: C59.1 L2.1 U6.6,7(SW)
NetC59_2: C59.2 U6.3(BST)
NetC60_1: C60.1 L3.1 U7.6,7(SW)
NetC60_2: C60.2 U7.3(BST)
NetC63_2: C63.2 U6.2(VCC)
NetC64_2: C64.2 U7.2(VCC)
NetC81_1: C81.1 L4.1 U8.6,7(SW)
NetC81_2: C81.2 U8.3(BST)
NetC82_1: C82.1 L5.1 U9.6,7(SW)
NetC82_2: C82.2 U9.3(BST)
NetC85_2: C85.2 U8.2(VCC)
NetC86_2: C86.2 U9.2(VCC)

### Notes on the sheet
- Project:
- Sub-system:
- Design by:
- Sheet title:
- Sheet
- of
- Checked by:
- Approved by:
- Revision:
- Document No:
- Size:
- Date:
- A3

### Library data of the parts
C43-C86 C87#1 = _CAP_C_2: CAP
J6 = Header 8x1_2M
L2-L5 = L-SMD-1: partNo: 78477010; Manufacturer: Wurth Elektronik; Inductance: 1.0 μH; ComponentLink1Description: Manufacturer; ComponentLink1URL: http://www.we-online.de; Created by: Baojun Chen; Created Date: Nov.2015; ComponentLink2Description: Datasheet; ComponentLink2URL: http://katalog.we-online.de/pbs/datasheet/78477010.pdf
R124 R125 R130 R132 R134 R135 R140 R142 R144#1 R145#1 R146#1 R147#1 R148#1 R149#1 = _RES_B_2: RES
U6-U9 = LT8722
U10#1 = IC_SW_MAX14662ETI+T: 8 Circuit IC Switch 1:1 1Ohm 28-TQFN _4x4_; MF: Maxim Integrated; Package: TQFN-28 Maxim; Value: *; Price: None; MP: MAX14662ETI+T; SnapEDA_Link: https://www.snapeda.com/parts/MAX14662ETI%2BT/Maxim%20Integrated/view-part/546683/?ref=snap; Availability: Unavailable

## Sheet 17_FLOW_Sensor.SchDoc
size 420 x 297 mm; SheetNumber: 27; SheetTotal: 36
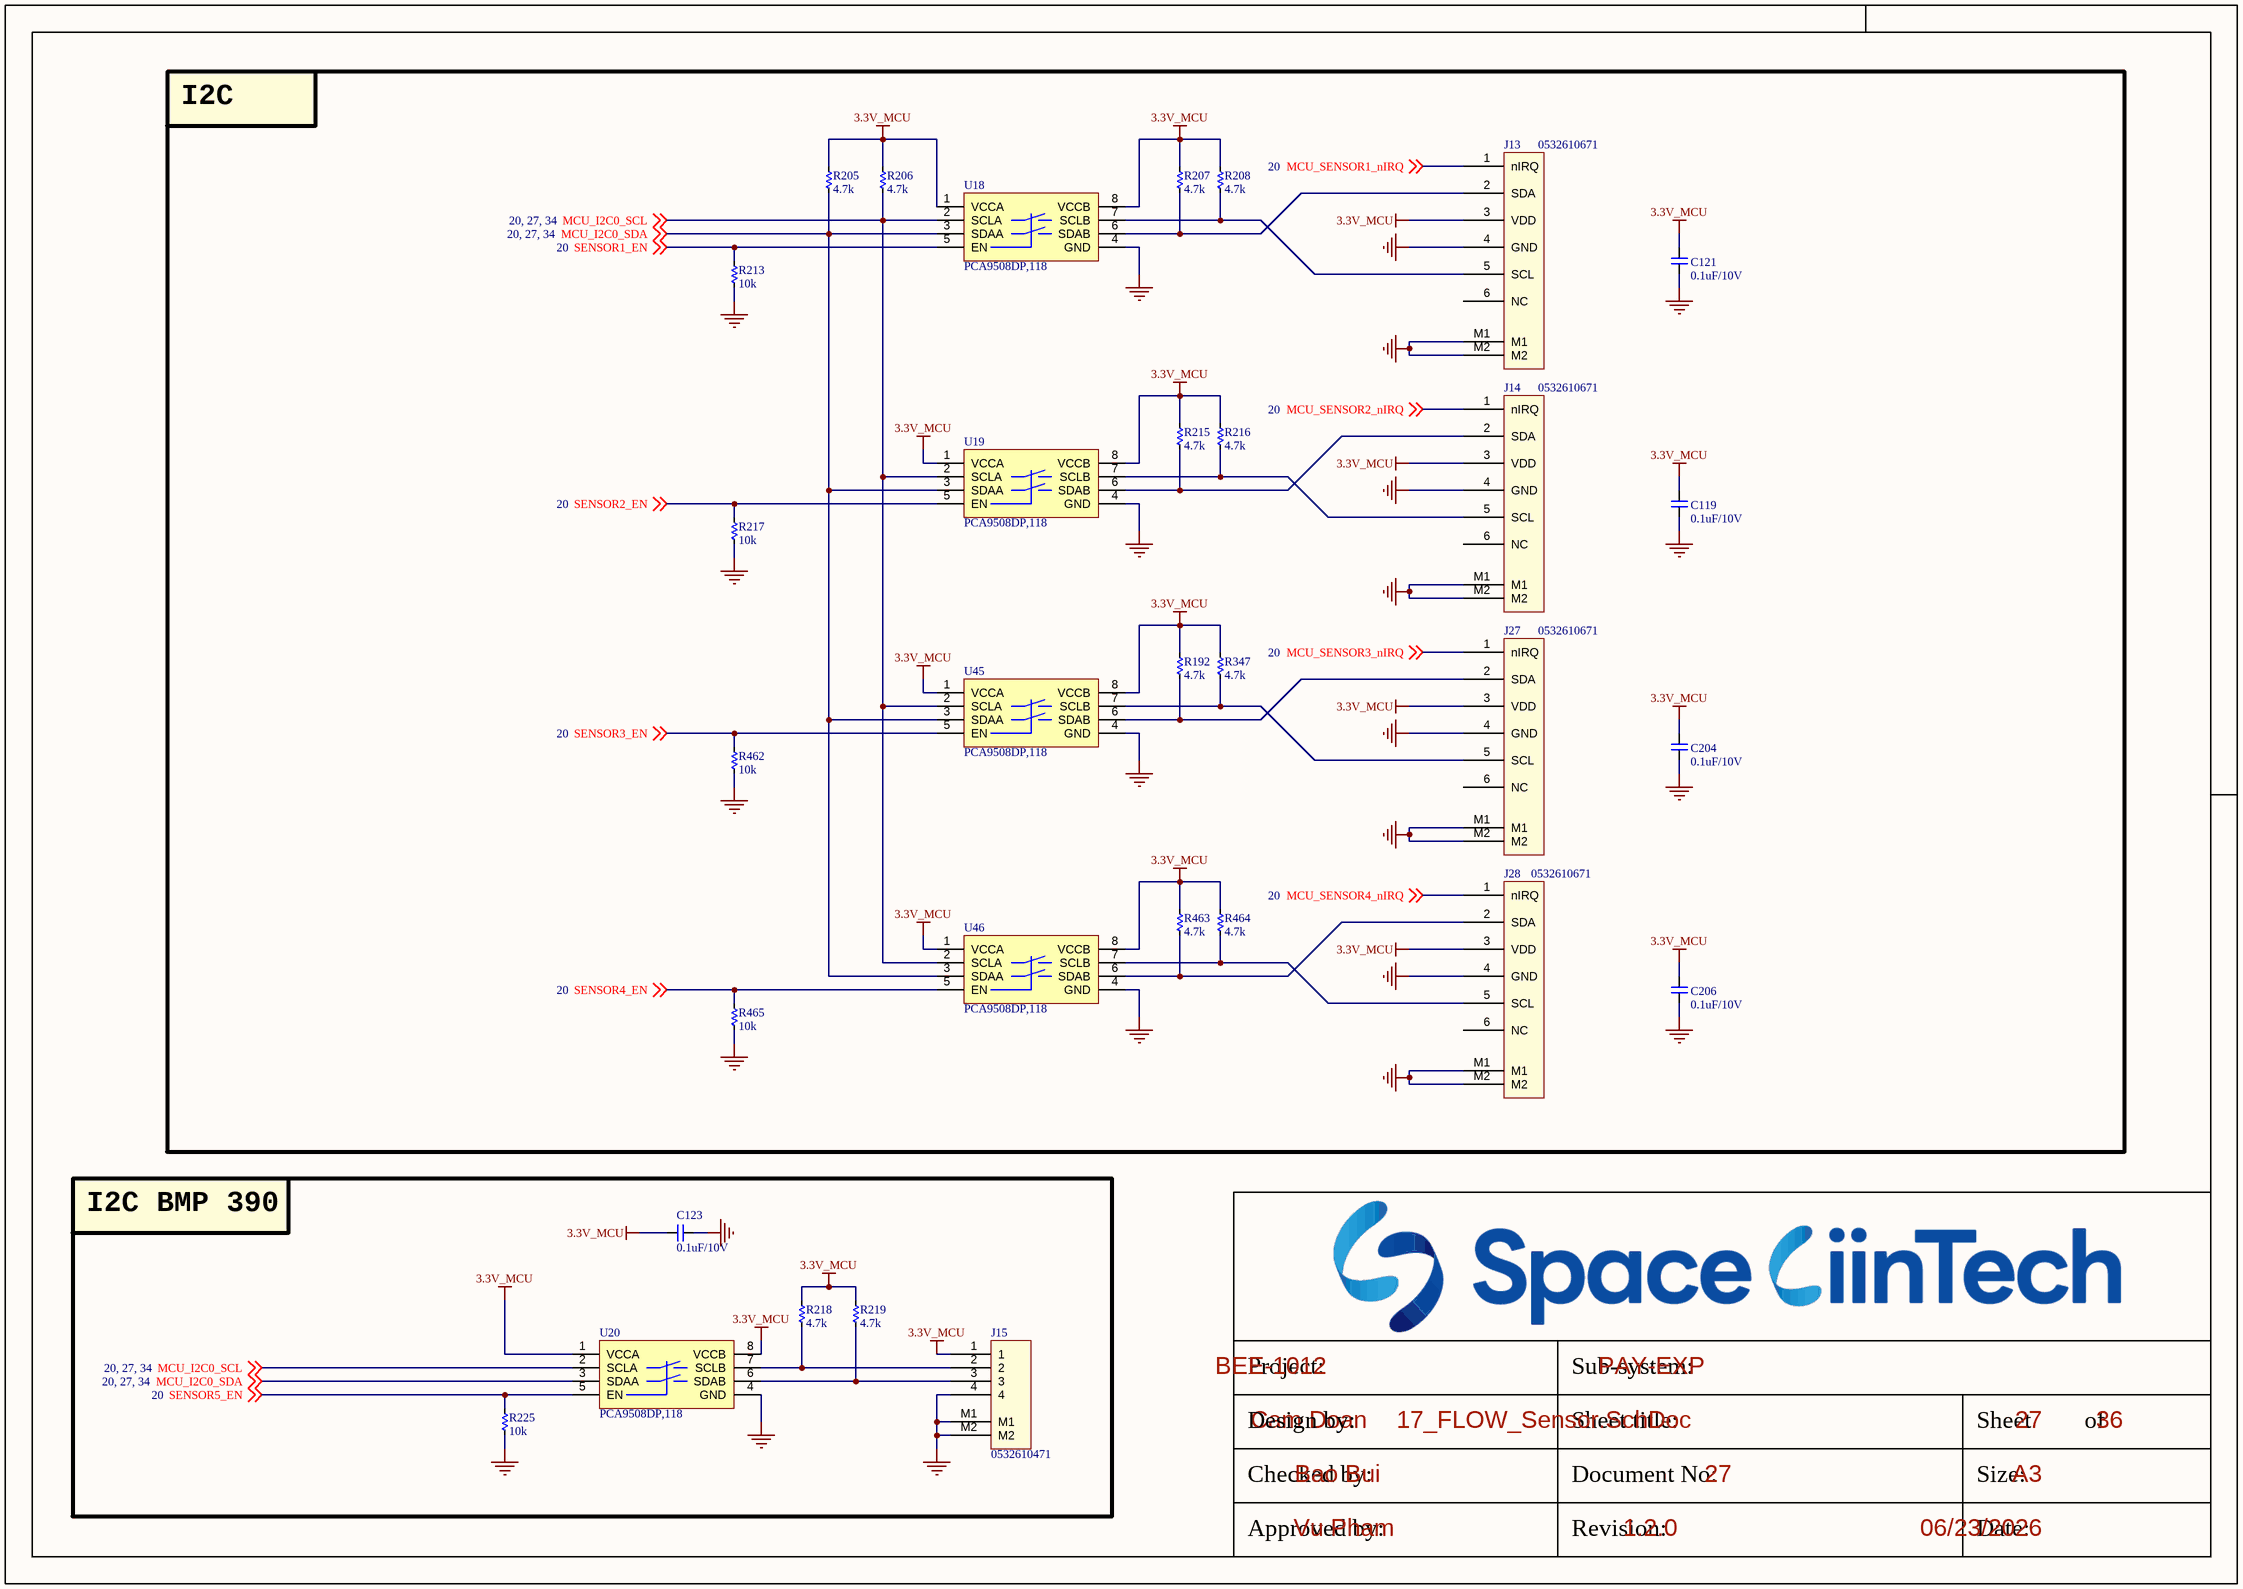
[diagram p27: 17_FLOW_Sensor.SchDoc]

### Parts
C119  0.1uF/10V  [CAP_C_1005X60]
C121  0.1uF/10V  [CAP_C_1005X60]
C123  0.1uF/10V  [CAP_C_1005X60]
C204  0.1uF/10V  [CAP_C_1005X60]
C206  0.1uF/10V  [CAP_C_1005X60]
J13  0532610671  [MOLEX_0532610671]
J14  0532610671  [MOLEX_0532610671]
J15  0532610471  [MOLEX_0532610471]
J27  0532610671  [MOLEX_0532610671]
J28  0532610671  [MOLEX_0532610671]
R192  4.7k  [RES_C_1005X40]
R205  4.7k  [RES_C_1005X40]
R206  4.7k  [RES_C_1005X40]
R207  4.7k  [RES_C_1005X40]
R208  4.7k  [RES_C_1005X40]
R213  10k  [RES_C_1005X40]
R215  4.7k  [RES_C_1005X40]
R216  4.7k  [RES_C_1005X40]
R217  10k  [RES_C_1005X40]
R218  4.7k  [RES_C_1005X40]
R219  4.7k  [RES_C_1005X40]
R225  10k  [RES_C_1005X40]
R347  4.7k  [RES_C_1005X40]
R462  10k  [RES_C_1005X40]
R463  4.7k  [RES_C_1005X40]
R464  4.7k  [RES_C_1005X40]
R465  10k  [RES_C_1005X40]
U18  PCA9508DP,118  [TSOP8]
U19  PCA9508DP,118  [TSOP8]
U20  PCA9508DP,118  [TSOP8]
U45  PCA9508DP,118  [TSOP8]
U46  PCA9508DP,118  [TSOP8]

### Blocks framed on the sheet
I2C: C119 C121 C204 C206 J13 J14 J27 J28 R192 R205-R208 R213 R215-R217 R347 R462-R465 U18 U19 U45 U46
I2C BMP 390: C123 J15 R218 R219 R225 U20

### Nets
3.3V_MCU: C119.2 C121.2 C123.2 C204.2 C206.2 J13.3(VDD) J14.3(VDD) J15.1 J27.3(VDD) J28.3(VDD) R192.1 R205.1 R206.1 R207.1 R208.1 R215.1 R216.1 R218.1 R219.1 R347.1 R463.1 R464.1 U18.1(VCCA) U18.8(VCCB) U19.1(VCCA) U19.8(VCCB) U20.1(VCCA) U20.8(VCCB) U45.1(VCCA) U45.8(VCCB) U46.1(VCCA) U46.8(VCCB)
GND: C119.1 C121.1 C123.1 C204.1 C206.1 J13.4(GND) J13.M1 J13.M2 J14.4(GND) J14.M1 J14.M2 J15.4 J15.M1 J15.M2 J27.4(GND) J27.M1 J27.M2 J28.4(GND) J28.M1 J28.M2 R213.2 R217.2 R225.2 R462.2 R465.2 U18.4(GND) U19.4(GND) U20.4(GND) U45.4(GND) U46.4(GND)
MCU_I2C0_SCL: R206.2 U18.2(SCLA) U19.2(SCLA) U20.2(SCLA) U45.2(SCLA) U46.2(SCLA) ; off-sheet MCU_I2C0_SCL
MCU_I2C0_SDA: R205.2 U18.3(SDAA) U19.3(SDAA) U20.3(SDAA) U45.3(SDAA) U46.3(SDAA) ; off-sheet MCU_I2C0_SDA
MCU_SENSOR1_nIRQ: J13.1(nIRQ) ; off-sheet MCU_SENSOR1_nIRQ
MCU_SENSOR2_nIRQ: J14.1(nIRQ) ; off-sheet MCU_SENSOR2_nIRQ
MCU_SENSOR3_nIRQ: J27.1(nIRQ) ; off-sheet MCU_SENSOR3_nIRQ
MCU_SENSOR4_nIRQ: J28.1(nIRQ) ; off-sheet MCU_SENSOR4_nIRQ
SENSOR1_EN: R213.1 U18.5(EN) ; off-sheet SENSOR1_EN
SENSOR2_EN: R217.1 U19.5(EN) ; off-sheet SENSOR2_EN
SENSOR3_EN: R462.1 U45.5(EN) ; off-sheet SENSOR3_EN
SENSOR4_EN: R465.1 U46.5(EN) ; off-sheet SENSOR4_EN
SENSOR5_EN: R225.1 U20.5(EN) ; off-sheet SENSOR5_EN
NetJ13_2: J13.2(SDA) R207.2 U18.6(SDAB)
NetJ13_5: J13.5(SCL) R208.2 U18.7(SCLB)
NetJ14_2: J14.2(SDA) R215.2 U19.6(SDAB)
NetJ14_5: J14.5(SCL) R216.2 U19.7(SCLB)
NetJ15_2: J15.2 R218.2 U20.7(SCLB)
NetJ15_3: J15.3 R219.2 U20.6(SDAB)
NetJ27_2: J27.2(SDA) R192.2 U45.6(SDAB)
NetJ27_5: J27.5(SCL) R347.2 U45.7(SCLB)
NetJ28_2: J28.2(SDA) R463.2 U46.6(SDAB)
NetJ28_5: J28.5(SCL) R464.2 U46.7(SCLB)

Not connected (* = marked no-connect by the designer): J13 6(NC); J14 6(NC); J27 6(NC); J28 6(NC)

### Notes on the sheet
- Project:
- Sub-system:
- Design by:
- Sheet title:
- Sheet
- of
- Checked by:
- Approved by:
- Revision:
- Document No:
- Size:
- Date:
- A3

### Library data of the parts
C119 C121 C123 C204 C206 = _CAP_C_2: CAP
J13 J14 J27 J28 = FLOW_SENSOR
J15 = Header 4x1_2M
R192 R205-R208 R213 R215-R219 R225 R347 R462-R465 = _RES_B_2: RES